# Altium project qfc_Alfa1.0.PrjPcb
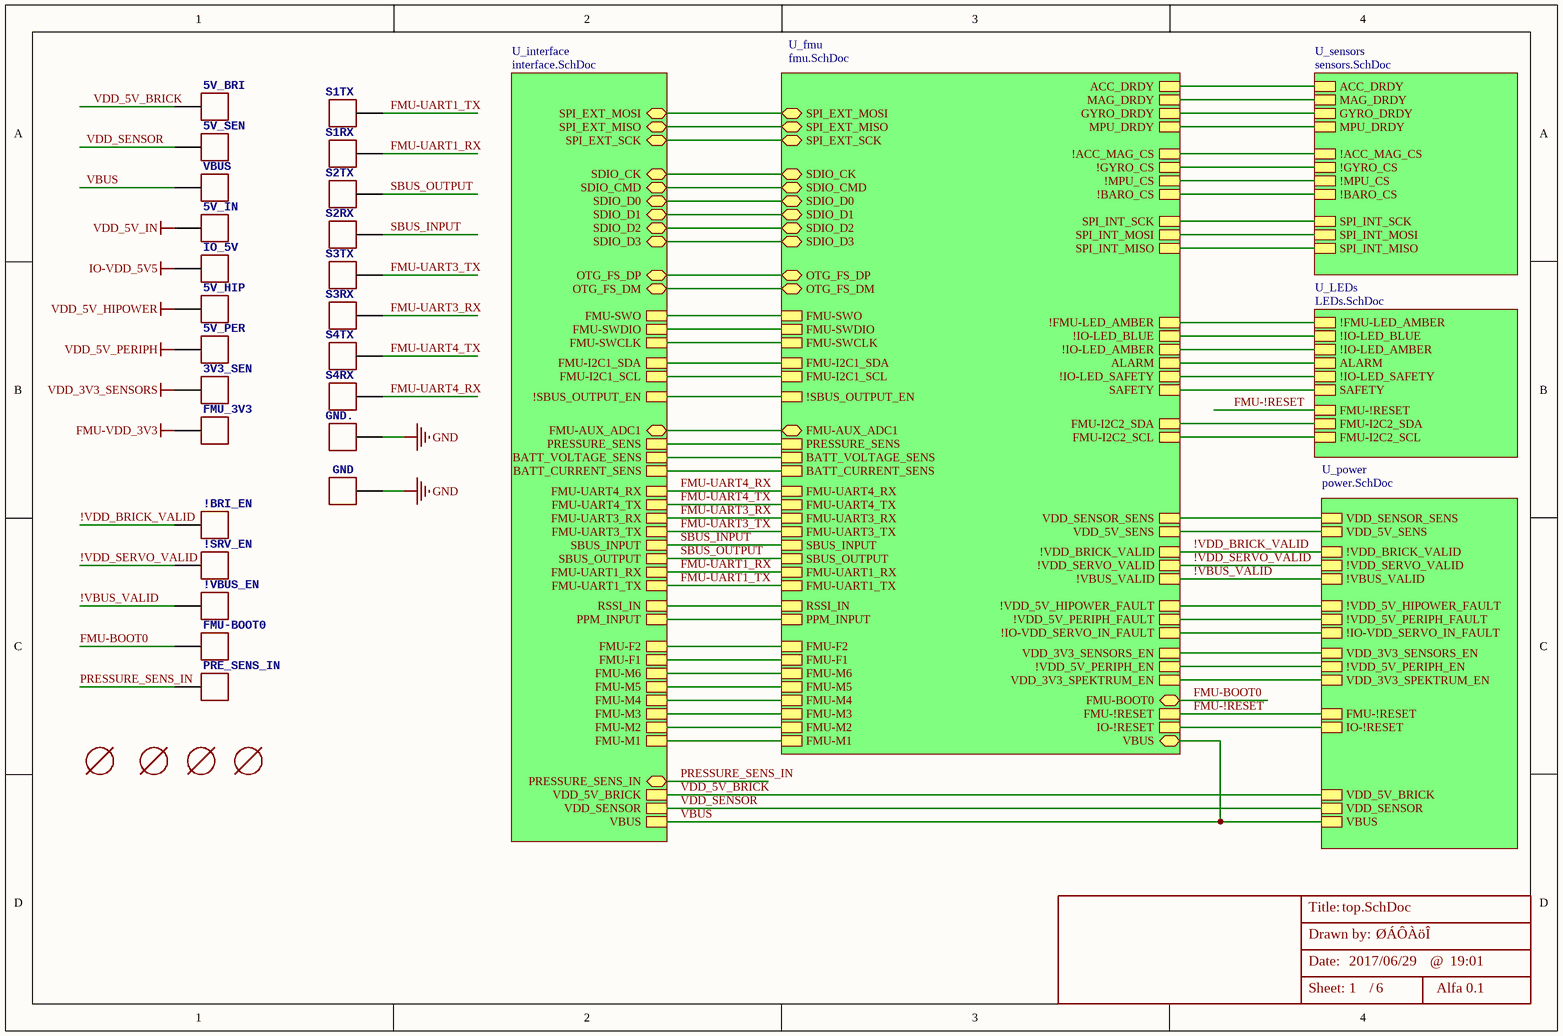
[diagram p0: top.SchDoc]
6 sheets, 217 parts. Net scope: hierarchical (ports join the sheet entries above them; power ports are global).
Board file: qfc.PcbDoc
Sheets:
  top.SchDoc
    U_interface = interface.SchDoc
    U_fmu = fmu.SchDoc
    U_LEDs = LEDs.SchDoc
    U_sensors = sensors.SchDoc
    U_power = power.SchDoc

## Sheet top.SchDoc: Your title
size A4; Date: 2017/06/29; DrawnBy: ØÁÔÀöÎ; Revision: Alfa 0.1; SheetNumber: 1; SheetTotal: 6; Time: 19:01

### Parts
3V3_SEN  PAD.04  [PAD.04X.04]  (value not drawn)
5V_BRI  PAD.04  [PAD.04X.04]  (value not drawn)
5V_HIP  PAD.04  [PAD.04X.04]  (value not drawn)
5V_IN  PAD.04  [PAD.04X.04]  (value not drawn)
5V_PER  PAD.04  [PAD.04X.04]  (value not drawn)
5V_SEN  PAD.04  [PAD.04X.04]  (value not drawn)
!BRI_EN  PAD.04  [PAD.04X.04]  (value not drawn)
!SRV_EN  PAD.04  [PAD.04X.04]  (value not drawn)
!VBUS_EN  PAD.04  [PAD.04X.04]  (value not drawn)
FMU-BOOT0  PAD.04  [PAD.04X.04]  (value not drawn)
FMU_3V3  PAD.04  [PAD.04X.04]  (value not drawn)
GND  PAD.04  [PAD.04X.04]  (value not drawn)
GND.  PAD.04  [PAD.04X.04]  (value not drawn)
IO_5V  PAD.04  [PAD.04X.04]  (value not drawn)
M100  MOUNT-HOLE1.8MM  [HOLE-3mm]  (value not drawn)
M101  MOUNT-HOLE1.8MM  [HOLE-3mm]  (value not drawn)
M102  MOUNT-HOLE1.8MM  [HOLE-3mm]  (value not drawn)
M103  MOUNT-HOLE1.8MM  [HOLE-3mm]  (value not drawn)
PRE_SENS_IN  PAD.04  [PAD.04X.04]  (value not drawn)
S1RX  PAD.04  [PAD.04X.04]  (value not drawn)
S1TX  PAD.04  [PAD.04X.04]  (value not drawn)
S2RX  PAD.04  [PAD.04X.04]  (value not drawn)
S2TX  PAD.04  [PAD.04X.04]  (value not drawn)
S3RX  PAD.04  [PAD.04X.04]  (value not drawn)
S3TX  PAD.04  [PAD.04X.04]  (value not drawn)
S4RX  PAD.04  [PAD.04X.04]  (value not drawn)
S4TX  PAD.04  [PAD.04X.04]  (value not drawn)
VBUS  PAD.04  [PAD.04X.04]  (value not drawn)

### Sub-sheets
U_fmu = fmu.SchDoc: FMU-M1, FMU-M2, FMU-M3, FMU-M4, FMU-M5, FMU-M6, FMU-F1, FMU-F2, PPM_INPUT, SBUS_INPUT, SBUS_OUTPUT, !SBUS_OUTPUT_EN, RSSI_IN, FMU-UART1_TX, FMU-UART1_RX, FMU-UART3_TX, FMU-UART3_RX, FMU-UART4_TX, FMU-UART4_RX, BATT_CURRENT_SENS, BATT_VOLTAGE_SENS, PRESSURE_SENS, FMU-I2C1_SCL, FMU-I2C1_SDA, FMU-SWCLK, FMU-SWDIO, FMU-SWO, !VDD_BRICK_VALID, !VDD_SERVO_VALID, !VBUS_VALID, VDD_SENSOR_SENS, VDD_3V3_SENSORS_EN, FMU-!RESET, !VDD_5V_HIPOWER_FAULT, !VDD_5V_PERIPH_FAULT, VDD_5V_SENS, !VDD_5V_PERIPH_EN, VDD_3V3_SPEKTRUM_EN, IO-!RESET, GYRO_DRDY, ACC_DRDY, MAG_DRDY, MPU_DRDY, !GYRO_CS, !ACC_MAG_CS, !MPU_CS, !BARO_CS, SPI_INT_SCK, SPI_INT_MOSI, SPI_INT_MISO, !FMU-LED_AMBER, !IO-LED_BLUE, !IO-LED_AMBER, FMU-I2C2_SDA, FMU-I2C2_SCL, !IO-LED_SAFETY, SAFETY, OTG_FS_DP, OTG_FS_DM, !IO-VDD_SERVO_IN_FAULT, FMU-AUX_ADC1, VBUS, ALARM, SDIO_CK, SDIO_CMD, SDIO_D0, SDIO_D1, SDIO_D2, SDIO_D3, SPI_EXT_MOSI, SPI_EXT_MISO, SPI_EXT_SCK, FMU-BOOT0
U_interface = interface.SchDoc: FMU-M1, FMU-M2, FMU-M3, FMU-M4, FMU-M5, FMU-M6, FMU-F1, FMU-F2, PPM_INPUT, SBUS_INPUT, SBUS_OUTPUT, !SBUS_OUTPUT_EN, RSSI_IN, FMU-UART1_TX, FMU-UART1_RX, FMU-UART3_TX, FMU-UART3_RX, FMU-UART4_TX, FMU-UART4_RX, VDD_SENSOR, VDD_5V_BRICK, BATT_CURRENT_SENS, BATT_VOLTAGE_SENS, PRESSURE_SENS, FMU-I2C1_SCL, FMU-I2C1_SDA, FMU-SWCLK, FMU-SWDIO, FMU-SWO, VBUS, OTG_FS_DP, OTG_FS_DM, SDIO_CK, SDIO_CMD, SDIO_D0, SDIO_D1, SDIO_D2, SDIO_D3, SPI_EXT_MOSI, SPI_EXT_MISO, SPI_EXT_SCK, FMU-AUX_ADC1, PRESSURE_SENS_IN
U_LEDs = LEDs.SchDoc: !FMU-LED_AMBER, !IO-LED_BLUE, !IO-LED_AMBER, ALARM, FMU-I2C2_SDA, FMU-I2C2_SCL, FMU-!RESET, !IO-LED_SAFETY, SAFETY
U_power = power.SchDoc: VBUS, VDD_5V_BRICK, VDD_SENSOR, !VDD_BRICK_VALID, !VDD_SERVO_VALID, !VBUS_VALID, VDD_SENSOR_SENS, VDD_3V3_SENSORS_EN, FMU-!RESET, !VDD_5V_HIPOWER_FAULT, !VDD_5V_PERIPH_FAULT, VDD_5V_SENS, !VDD_5V_PERIPH_EN, !IO-VDD_SERVO_IN_FAULT, VDD_3V3_SPEKTRUM_EN, IO-!RESET
U_sensors = sensors.SchDoc: GYRO_DRDY, ACC_DRDY, MAG_DRDY, MPU_DRDY, !GYRO_CS, !ACC_MAG_CS, !MPU_CS, !BARO_CS, SPI_INT_SCK, SPI_INT_MOSI, SPI_INT_MISO

### Nets
FMU-VDD_3V3: FMU_3V3.P$1
GND: GND.P$1 GND..P$1
IO-VDD_5V5: IO_5V.P$1
VDD_3V3_SENSORS: 3V3_SEN.P$1
VDD_5V_HIPOWER: 5V_HIP.P$1
VDD_5V_IN: 5V_IN.P$1
VDD_5V_PERIPH: 5V_PER.P$1
!VBUS_VALID: !VBUS_EN.P$1 ; sheet U_fmu/!VBUS_VALID, sheet U_power/!VBUS_VALID
!VDD_BRICK_VALID: !BRI_EN.P$1 ; sheet U_fmu/!VDD_BRICK_VALID, sheet U_power/!VDD_BRICK_VALID
!VDD_SERVO_VALID: !SRV_EN.P$1 ; sheet U_fmu/!VDD_SERVO_VALID, sheet U_power/!VDD_SERVO_VALID
FMU-!RESET: sheet U_fmu/FMU-!RESET, sheet U_LEDs/FMU-!RESET, sheet U_power/FMU-!RESET
FMU-BOOT0: FMU-BOOT0.P$1 ; sheet U_fmu/FMU-BOOT0
FMU-UART1_RX: S1RX.P$1 ; sheet U_interface/FMU-UART1_RX, sheet U_fmu/FMU-UART1_RX
FMU-UART1_TX: S1TX.P$1 ; sheet U_interface/FMU-UART1_TX, sheet U_fmu/FMU-UART1_TX
FMU-UART3_RX: S3RX.P$1 ; sheet U_interface/FMU-UART3_RX, sheet U_fmu/FMU-UART3_RX
FMU-UART3_TX: S3TX.P$1 ; sheet U_interface/FMU-UART3_TX, sheet U_fmu/FMU-UART3_TX
FMU-UART4_RX: S4RX.P$1 ; sheet U_interface/FMU-UART4_RX, sheet U_fmu/FMU-UART4_RX
FMU-UART4_TX: S4TX.P$1 ; sheet U_interface/FMU-UART4_TX, sheet U_fmu/FMU-UART4_TX
PRESSURE_SENS_IN: PRE_SENS_IN.P$1 ; sheet U_interface/PRESSURE_SENS_IN
SBUS_INPUT: S2RX.P$1 ; sheet U_interface/SBUS_INPUT, sheet U_fmu/SBUS_INPUT
SBUS_OUTPUT: S2TX.P$1 ; sheet U_interface/SBUS_OUTPUT, sheet U_fmu/SBUS_OUTPUT
SPI_INT_MISO: sheet U_fmu/SPI_INT_MISO, sheet U_sensors/SPI_INT_MISO
SPI_INT_MOSI: sheet U_fmu/SPI_INT_MOSI, sheet U_sensors/SPI_INT_MOSI
SPI_INT_SCK: sheet U_fmu/SPI_INT_SCK, sheet U_sensors/SPI_INT_SCK
VBUS: VBUS.P$1 ; sheet U_interface/VBUS, sheet U_fmu/VBUS, sheet U_power/VBUS
VDD_5V_BRICK: 5V_BRI.P$1 ; sheet U_interface/VDD_5V_BRICK, sheet U_power/VDD_5V_BRICK
VDD_SENSOR: 5V_SEN.P$1 ; sheet U_interface/VDD_SENSOR, sheet U_power/VDD_SENSOR
NetC502_P$2: sheet U_interface/PRESSURE_SENS, sheet U_fmu/PRESSURE_SENS
NetD501_C: sheet U_interface/PPM_INPUT, sheet U_fmu/PPM_INPUT
NetJ400_GND: sheet U_fmu/SAFETY, sheet U_LEDs/SAFETY
NetJ507_2: sheet U_interface/SPI_EXT_SCK, sheet U_fmu/SPI_EXT_SCK
NetJ507_3: sheet U_interface/SPI_EXT_MOSI, sheet U_fmu/SPI_EXT_MOSI
NetJ507_4: sheet U_interface/SPI_EXT_MISO, sheet U_fmu/SPI_EXT_MISO
NetJ508_2: sheet U_interface/FMU-SWCLK, sheet U_fmu/FMU-SWCLK
NetJ508_3: sheet U_interface/FMU-SWDIO, sheet U_fmu/FMU-SWDIO
NetJ508_4: sheet U_interface/FMU-SWO, sheet U_fmu/FMU-SWO
NetR200_1: sheet U_fmu/VDD_3V3_SENSORS_EN, sheet U_power/VDD_3V3_SENSORS_EN
NetR214_1: sheet U_fmu/VDD_5V_SENS, sheet U_power/VDD_5V_SENS
NetR219_2: sheet U_fmu/!VDD_5V_PERIPH_EN, sheet U_power/!VDD_5V_PERIPH_EN
NetR225_1: sheet U_fmu/VDD_SENSOR_SENS, sheet U_power/VDD_SENSOR_SENS
NetR227_2: sheet U_fmu/VDD_3V3_SPEKTRUM_EN, sheet U_power/VDD_3V3_SPEKTRUM_EN
NetR403_1: sheet U_fmu/!IO-LED_BLUE, sheet U_LEDs/!IO-LED_BLUE
NetR405_1: sheet U_fmu/!FMU-LED_AMBER, sheet U_LEDs/!FMU-LED_AMBER
NetR406_1: sheet U_fmu/!IO-LED_AMBER, sheet U_LEDs/!IO-LED_AMBER
NetR410_1: sheet U_fmu/!IO-LED_SAFETY, sheet U_LEDs/!IO-LED_SAFETY
NetR411_1: sheet U_fmu/ALARM, sheet U_LEDs/ALARM
NetR500_2: sheet U_interface/BATT_CURRENT_SENS, sheet U_fmu/BATT_CURRENT_SENS
NetR503_2: sheet U_interface/BATT_VOLTAGE_SENS, sheet U_fmu/BATT_VOLTAGE_SENS
NetR516_1: sheet U_interface/FMU-AUX_ADC1, sheet U_fmu/FMU-AUX_ADC1
NetR521_2: sheet U_interface/FMU-I2C1_SCL, sheet U_fmu/FMU-I2C1_SCL
NetR522_2: sheet U_interface/FMU-I2C1_SDA, sheet U_fmu/FMU-I2C1_SDA
NetR527_1: sheet U_interface/RSSI_IN, sheet U_fmu/RSSI_IN
NetR528_1: sheet U_interface/SDIO_D2, sheet U_fmu/SDIO_D2
NetR529_1: sheet U_interface/SDIO_D3, sheet U_fmu/SDIO_D3
NetR530_1: sheet U_interface/SDIO_CMD, sheet U_fmu/SDIO_CMD
NetR531_1: sheet U_interface/SDIO_D0, sheet U_fmu/SDIO_D0
NetR532_1: sheet U_interface/SDIO_D1, sheet U_fmu/SDIO_D1
NetU204_4: sheet U_fmu/!VDD_5V_HIPOWER_FAULT, sheet U_power/!VDD_5V_HIPOWER_FAULT
NetU205_4: sheet U_fmu/!VDD_5V_PERIPH_FAULT, sheet U_power/!VDD_5V_PERIPH_FAULT
NetU207_4: sheet U_fmu/!IO-VDD_SERVO_IN_FAULT, sheet U_power/!IO-VDD_SERVO_IN_FAULT
NetU208_3: sheet U_fmu/IO-!RESET, sheet U_power/IO-!RESET
NetU300_5: sheet U_fmu/!BARO_CS, sheet U_sensors/!BARO_CS
NetU301_5: sheet U_fmu/!GYRO_CS, sheet U_sensors/!GYRO_CS
NetU301_6: sheet U_fmu/GYRO_DRDY, sheet U_sensors/GYRO_DRDY
NetU302_8: sheet U_fmu/!MPU_CS, sheet U_sensors/!MPU_CS
NetU302_12: sheet U_fmu/MPU_DRDY, sheet U_sensors/MPU_DRDY
NetU303_8: sheet U_fmu/!ACC_MAG_CS, sheet U_sensors/!ACC_MAG_CS
NetU303_9: sheet U_fmu/MAG_DRDY, sheet U_sensors/MAG_DRDY
NetU303_11: sheet U_fmu/ACC_DRDY, sheet U_sensors/ACC_DRDY
NetU401_2: sheet U_fmu/FMU-I2C2_SDA, sheet U_LEDs/FMU-I2C2_SDA
NetU401_3: sheet U_fmu/FMU-I2C2_SCL, sheet U_LEDs/FMU-I2C2_SCL
NetU500_1: sheet U_interface/FMU-M1, sheet U_fmu/FMU-M1
NetU500_3: sheet U_interface/FMU-M2, sheet U_fmu/FMU-M2
NetU500_4: sheet U_interface/FMU-M3, sheet U_fmu/FMU-M3
NetU500_5: sheet U_interface/FMU-M4, sheet U_fmu/FMU-M4
NetU500_6: sheet U_interface/FMU-M5, sheet U_fmu/FMU-M5
NetU500_7: sheet U_interface/FMU-M6, sheet U_fmu/FMU-M6
NetU500_8: sheet U_interface/FMU-F1, sheet U_fmu/FMU-F1
NetU500_9: sheet U_interface/FMU-F2, sheet U_fmu/FMU-F2
NetU502_7: sheet U_interface/!SBUS_OUTPUT_EN, sheet U_fmu/!SBUS_OUTPUT_EN
NetU503_4: sheet U_interface/OTG_FS_DP, sheet U_fmu/OTG_FS_DP
NetU503_6: sheet U_interface/OTG_FS_DM, sheet U_fmu/OTG_FS_DM
NetU504_5: sheet U_interface/SDIO_CK, sheet U_fmu/SDIO_CK

### Notes on the sheet
- Title:
- Date:
- Drawn by:
- @
- Sheet:       /

### Library data of the parts
3V3_SEN = PAD.04: VDD_3V3_SENSORS; BOM: EXCLUDE; PARTNO: *
5V_BRI = PAD.04: VDD_5V_BRICK; BOM: EXCLUDE; PARTNO: *
5V_HIP = PAD.04: VDD_5V_HIPOWER; BOM: EXCLUDE; PARTNO: *
5V_IN = PAD.04: VDD_5V_IN; BOM: EXCLUDE; PARTNO: *
5V_PER = PAD.04: VDD_5V_PERIPH; BOM: EXCLUDE; PARTNO: *
5V_SEN = PAD.04: VDD_SENSOR; BOM: EXCLUDE; PARTNO: *
!BRI_EN = PAD.04: !VDD_BRICK_VALID; BOM: EXCLUDE; PARTNO: *
!SRV_EN = PAD.04: !VDD_SERVO_VALID; BOM: EXCLUDE; PARTNO: *
!VBUS_EN = PAD.04: !VBUS_VALID; BOM: EXCLUDE; PARTNO: *
FMU-BOOT0 GND GND. S1RX S1TX S2RX S2TX S3RX S3TX S4RX S4TX VBUS = PAD.04: BOM: EXCLUDE; PARTNO: *
FMU_3V3 = PAD.04: FMU-VDD_3V3; BOM: EXCLUDE; PARTNO: *
IO_5V = PAD.04: IO-VDD_5V5; BOM: EXCLUDE; PARTNO: *
M100-M103 = MOUNT-HOLE1.8MM: BOM: EXCLUDE; PARTNO: *
PRE_SENS_IN = PAD.04: PRESSURE_SENS_IN; BOM: EXCLUDE; PARTNO: *

## Sheet interface.SchDoc: Your title
size A4; Date: 2017/06/29; DrawnBy: 亓岳鑫; Revision: Alfa 0.1; SheetNumber: 5; SheetTotal: 6; Time: 19:01
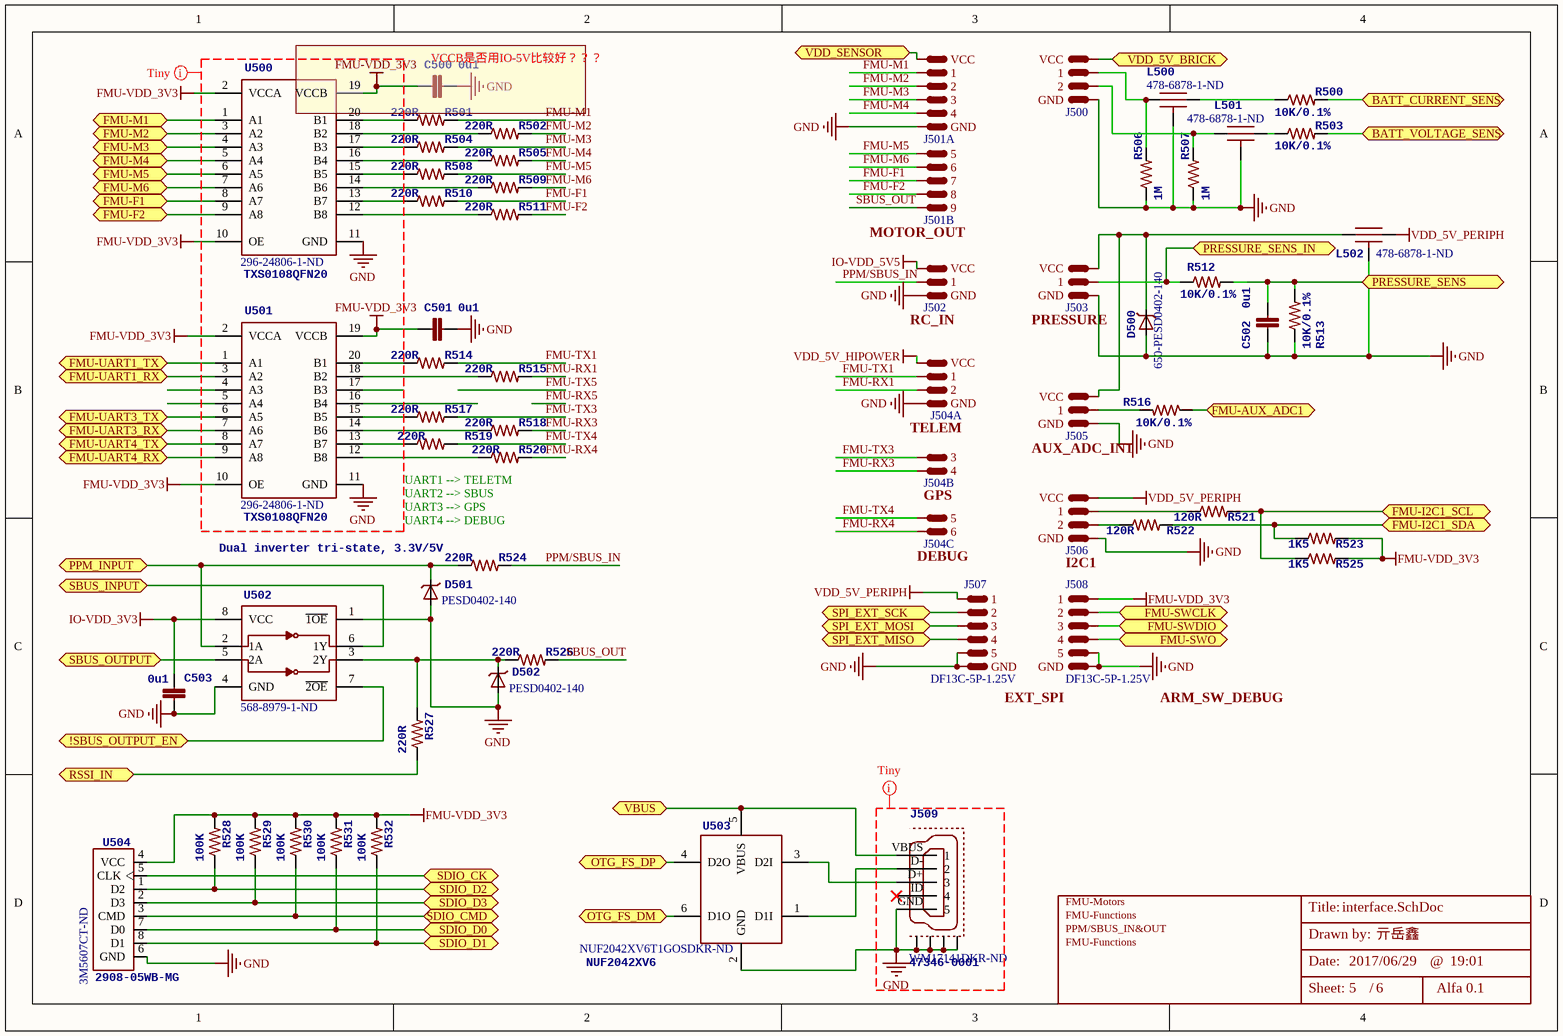
[diagram p1: interface.SchDoc]

### Parts
C500  0u1  [0603-CAP]
C501  0u1  [0603-CAP]
C502  0u1  [0603-CAP]
C503  0u1  [0603-CAP]
D500  Supplier Part Number 1: 650-PESD0402-140  [0402-TVS]  (hidden comment: DIODE-TVS)
D501  PARTNO: PESD0402-140  [0402-TVS]  (hidden comment: DIODE-TVS)
D502  PARTNO: PESD0402-140  [0402-TVS]  (hidden comment: DIODE-TVS)
J500  HDR 3X2  [HDR3X2H]  (value not drawn)
J501  HDR 3X9  [HDR3X9H]  (value not drawn)  (parts A,B of 2)
J502  HDR 3X1  [HDR3X1H]  (value not drawn)
J503  HDR 3X1  [HDR3X1H]  (value not drawn)
J504  HDR 4X3  [HDR4X3]  (value not drawn)  (parts A,B,C of 3)
J505  HDR 3X1  [HDR3X1H]  (value not drawn)
J506  HDR 4X1  [HDR4X1]  (value not drawn)
J507  DF13C-5P-1.25V  [1.25-5P]
J508  DF13C-5P-1.25V  [1.25-5P]
J509  47346-0001  Supplier Part Number 1: WM17141DKR-ND  [MOLEX-47346-0001]
L500  Supplier Part Number 1: 478-6878-1-ND  [KYOCERA-KNH16-DA]  (hidden comment: Kyocera KNH16C104DA5TS EMI filter)
L501  Supplier Part Number 1: 478-6878-1-ND  [KYOCERA-KNH16-DA]  (hidden comment: Kyocera KNH16C104DA5TS EMI filter)
L502  Supplier Part Number 1: 478-6878-1-ND  [KYOCERA-KNH16-DA]  (hidden comment: Kyocera KNH16C104DA5TS EMI filter)
R500  10K/0.1%  [0603-RES]
R501  220R  [0603-RES]
R502  220R  [0603-RES]
R503  10K/0.1%  [0603-RES]
R504  220R  [0603-RES]
R505  220R  [0603-RES]
R506  1M  [0603-RES]
R507  1M  [0603-RES]
R508  220R  [0603-RES]
R509  220R  [0603-RES]
R510  220R  [0603-RES]
R511  220R  [0603-RES]
R512  10K/0.1%  [0603-RES]
R513  10K/0.1%  [0603-RES]
R514  220R  [0603-RES]
R515  220R  [0603-RES]
R516  10K/0.1%  [0603-RES]
R517  220R  [0603-RES]
R518  220R  [0603-RES]
R519  220R  [0603-RES]
R520  220R  [0603-RES]
R521  120R  [0603-RES]
R522  120R  [0603-RES]
R523  1K5  [0603-RES]
R524  220R  [0603-RES]
R525  1K5  [0603-RES]
R526  220R  [0603-RES]
R527  220R  [0603-RES]
R528  100K  [0603-RES]
R529  100K  [0603-RES]
R530  100K  [0603-RES]
R531  100K  [0603-RES]
R532  100K  [0603-RES]
U500  TXS0108QFN20  Supplier Part Number 1: 296-24806-1-ND  [QFN20-RGY]
U501  TXS0108QFN20  Supplier Part Number 1: 296-24806-1-ND  [QFN20-RGY]
U502  Dual inverter tri-state, 3.3V/5V  Supplier Part Number 1: 568-8979-1-ND  [TSSOP8_SOT505-2]
U503  NUF2042XV6  Supplier Part Number 1: NUF2042XV6T1GOSDKR-ND  [SOT563-6]
U504  2908-05WB-MG  Supplier Part Number 1: 3M5607CT-ND  [MICROSD]

### Blocks framed on the sheet
VCCB是否用IO-5V比较好？？？: C500

### Ports
!SBUS_OUTPUT_EN, BATT_CURRENT_SENS, BATT_VOLTAGE_SENS, FMU-AUX_ADC1, FMU-F1, FMU-F2, FMU-I2C1_SCL, FMU-I2C1_SDA, FMU-M1, FMU-M2, FMU-M3, FMU-M4, FMU-M5, FMU-M6, FMU-SWCLK, FMU-SWDIO, FMU-SWO, FMU-UART1_RX, FMU-UART1_TX, FMU-UART3_RX, FMU-UART3_TX, FMU-UART4_RX, FMU-UART4_TX, OTG_FS_DM, OTG_FS_DP, PPM_INPUT, PRESSURE_SENS, PRESSURE_SENS_IN, RSSI_IN, SBUS_INPUT, SBUS_OUTPUT, SDIO_CK, SDIO_CMD, SDIO_D0, SDIO_D1, SDIO_D2, SDIO_D3, SPI_EXT_MISO, SPI_EXT_MOSI, SPI_EXT_SCK, VBUS, VDD_5V_BRICK, VDD_SENSOR

### Nets
FMU-VDD_3V3: C500.P$1 C501.P$1 C503.P$1 J508.1 R523.2 R525.2 R528.2 R529.2 R530.2 R531.2 R532.2 U500.2(VCCA) U500.10(OE) U500.19(VCCB) U501.2(VCCA) U501.10(OE) U501.19(VCCB) U502.8(VCC) U504.4(VCC)  [also labelled IO-VDD_3V3]
GND: C500.P$2 C501.P$2 C502.P$1 C503.P$2 D500.A D501.A D502.A J500.GND J501.GND J502.GND J503.GND J504.GND J505.GND J506.GND J507.5 J507.GND J508.5 J508.GND J509.GND(5) J509.GND1 J509.GND2 J509.GND3 J509.GND4 L500.GND L501.GND L502.GND R506.1 R507.1 R513.1 U500.11(GND) U501.11(GND) U502.1(~{1OE}) U502.4(GND) U503.2(GND) U504.6(GND)
IO-VDD_5V5: J502.VCC
VDD_5V_HIPOWER: J504.VCC
VDD_5V_PERIPH: J506.VCC J507.1 L502.P$2
FMU-F1: J501.7 R510.2
FMU-F2: J501.8 R511.2
FMU-M1: J501.1 R501.2
FMU-M2: J501.2 R502.2
FMU-M3: J501.3 R504.2
FMU-M4: J501.4 R505.2
FMU-M5: J501.5 R508.2
FMU-M6: J501.6 R509.2
FMU-RX1: J504.2 R515.2
FMU-RX3: J504.4 R518.2
FMU-RX4: J504.6 R520.2
FMU-TX1: J504.1 R514.2
FMU-TX3: J504.3 R517.2
FMU-TX4: J504.5 R519.2
FMU-UART1_RX: U501.3(A2) ; port FMU-UART1_RX
FMU-UART1_TX: U501.1(A1) ; port FMU-UART1_TX
FMU-UART3_RX: U501.7(A6) ; port FMU-UART3_RX
FMU-UART3_TX: U501.6(A5) ; port FMU-UART3_TX
FMU-UART4_RX: U501.9(A8) ; port FMU-UART4_RX
FMU-UART4_TX: U501.8(A7) ; port FMU-UART4_TX
PPM/SBUS_IN: J502.1 R524.2
PRESSURE_SENS_IN: J503.1 R512.1 ; port PRESSURE_SENS_IN
SBUS_INPUT: U502.6(1Y) ; port SBUS_INPUT
SBUS_OUT: J501.9 R526.2
SBUS_OUTPUT: U502.5(2A) ; port SBUS_OUTPUT
VBUS: J509.VBUS(1) U503.5(VBUS) ; port VBUS
VDD_5V_BRICK: J500.VCC ; port VDD_5V_BRICK
VDD_SENSOR: J501.VCC ; port VDD_SENSOR
NetC502_P$2: C502.P$2 R512.2 R513.2 ; port PRESSURE_SENS
NetD500_C: D500.C J503.VCC J505.VCC L502.P$1
NetD501_C: D501.C R524.1 U502.2(1A) ; port PPM_INPUT
NetD502_C: D502.C R526.1 R527.2 U502.3(2Y)
NetJ500_1: J500.1 L500.P$1 R506.2
NetJ500_2: J500.2 L501.P$1 R507.2
NetJ505_1: J505.1 R516.2
NetJ506_1: J506.1 R521.1
NetJ506_2: J506.2 R522.1
NetJ507_2: J507.2 ; port SPI_EXT_SCK
NetJ507_3: J507.3 ; port SPI_EXT_MOSI
NetJ507_4: J507.4 ; port SPI_EXT_MISO
NetJ508_2: J508.2 ; port FMU-SWCLK
NetJ508_3: J508.3 ; port FMU-SWDIO
NetJ508_4: J508.4 ; port FMU-SWO
NetJ509_D+: J509.D+(3) U503.3(D2I)
NetJ509_D-: J509.D-(2) U503.1(D1I)
NetL500_P$2: L500.P$2 R500.1
NetL501_P$2: L501.P$2 R503.1
NetR500_2: R500.2 ; port BATT_CURRENT_SENS
NetR501_1: R501.1 U500.20(B1)
NetR502_1: R502.1 U500.18(B2)
NetR503_2: R503.2 ; port BATT_VOLTAGE_SENS
NetR504_1: R504.1 U500.17(B3)
NetR505_1: R505.1 U500.16(B4)
NetR508_1: R508.1 U500.15(B5)
NetR509_1: R509.1 U500.14(B6)
NetR510_1: R510.1 U500.13(B7)
NetR511_1: R511.1 U500.12(B8)
NetR514_1: R514.1 U501.20(B1)
NetR515_1: R515.1 U501.18(B2)
NetR516_1: R516.1 ; port FMU-AUX_ADC1
NetR517_1: R517.1 U501.15(B5)
NetR518_1: R518.1 U501.14(B6)
NetR519_1: R519.1 U501.13(B7)
NetR520_1: R520.1 U501.12(B8)
NetR521_2: R521.2 R525.1 ; port FMU-I2C1_SCL
NetR522_2: R522.2 R523.1 ; port FMU-I2C1_SDA
NetR527_1: R527.1 ; port RSSI_IN
NetR528_1: R528.1 U504.1(D2) ; port SDIO_D2
NetR529_1: R529.1 U504.2(D3) ; port SDIO_D3
NetR530_1: R530.1 U504.3(CMD) ; port SDIO_CMD
NetR531_1: R531.1 U504.7(D0) ; port SDIO_D0
NetR532_1: R532.1 U504.8(D1) ; port SDIO_D1
NetU500_1: U500.1(A1) ; port FMU-M1
NetU500_3: U500.3(A2) ; port FMU-M2
NetU500_4: U500.4(A3) ; port FMU-M3
NetU500_5: U500.5(A4) ; port FMU-M4
NetU500_6: U500.6(A5) ; port FMU-M5
NetU500_7: U500.7(A6) ; port FMU-M6
NetU500_8: U500.8(A7) ; port FMU-F1
NetU500_9: U500.9(A8) ; port FMU-F2
NetU502_7: U502.7(~{2OE}) ; port !SBUS_OUTPUT_EN
NetU503_4: U503.4(D2O) ; port OTG_FS_DP
NetU503_6: U503.6(D1O) ; port OTG_FS_DM
NetU504_5: U504.5(CLK) ; port SDIO_CK

Not connected (* = marked no-connect by the designer): J509 ID(4)*; U501 4(A3) 5(A4) 16(B4) 17(B3)

### Layout directives
net class Tiny_componet: FMU-VDD_3V3, GND

### Notes on the sheet
- MOTOR_OUT
- (near J502) RC_IN
- (near J503) PRESSURE
- (near J504) TELEM
- (near J504) GPS
- (near J505) AUX_ADC_IN1
- (near R520) UART1 --> TELETM
  UART2 --> SBUS
  UART3 --> GPS
  UART4 --> DEBUG
- (near J504) DEBUG
- I2C1
- (near J507) EXT_SPI
- (near J508) ARM_SW_DEBUG
- FMU-Motors
- FMU-Functions
- PPM/SBUS_IN&OUT
- Title:
- Date:
- Drawn by:
- @
- Sheet:       /

### Library data of the parts
C500-C503 = CAP0603: CAP CER 2.2UF 16V 10% X6S 0603; PARTNO: C1608X6S1C225K080AC; 3DR_PARTNO: ECM0619; Supplier 1: Digi-Key; Value: 0u1; Supplier Part Number 1: 445-7438-1-ND
D500 = DIODE-TVS: TVS DIODE 14VWM 40VC 0402; 3DR_PARTNO: ECM0837; PARTNO: PESD0402-140; Value: 40v; Supplier 1: Mouser
D501 D502 = DIODE-TVS: TVS DIODE 14VWM 40VC 0402; 3DR_PARTNO: ECM0837; Value: 40v; Supplier 1: Mouser; Supplier Part Number 1: 650-PESD0402-140
J500 = HDR 3X2: Header 3X2 pins
J501 = HDR 3X9: Header 3X9 pins
J502 J503 J505 = HDR 3X1: Header 3X1 pins
J504 = HDR 4X3: Header 4X3
J506 = HDR 4X1: Header 4X1
J507 J508 = DF13C-5P-1.25V: DF13C-5P-1.25V, 1.25mm
J509 = MOLEX-47346-0001: MICRO USB B, BOTTOM MOUNT; 3DR_PARTNO: ECM0486; PARTNO: 0473460001; Supplier 1: Digi-Key
L500-L502 = KNH16C104DA5TS: FILTER CAP 0.1UF 2A 25V 0603; 3DR_PARTNO: ECM0719; Value: 0u1; Supplier 1: Digi-Key; PARTNO: KNH16C104DA5TS
R500-R532 = RESISTOR0603-RES: RES 10 OHM 1/10W 5% 0603; PARTNO: RC1608J100CS; 3DR_PARTNO: ECM0811; Supplier 1: Digi-Key; Supplier Part Number 1: 1276-5014-1-ND
  R500 R503 R512 R513 R516: Value: 10K/0.1%
  R501 R502 R504 R505 R508-R511 R514 R515 R517-R520 R524 R526 R527: Value: 220R
  R506 R507: Value: 1M
  R521 R522: Value: 120R
  R523 R525: Value: 1K5
  R528-R532: Value: 100K
U500 U501 = TXS0108QFN20: IC XLATR VOLT-LVL 8B BDIR 20QFN; 3DR_PARTNO: ECM0845; PARTNO: TXS0108ERGYR; Supplier 1: Digi-Key
U502 = 74LVC2G240-TSSOP-8: IC INVERTER DUAL 4-INPUT 8TSSOP; 3DR_PARTNO: ECM0817; PARTNO: 74LVC2G240DP,125; Value: INV; Supplier 1: Digi-Key
U503 = NUF2042XV6: IC FILTER USB ESD PROTECT SOT363; PARTNO: NUF2042XV6T1G; 3DR_PARTNO: ECM0836; Supplier 1: Digi-Key
U504 = MICROSDSDI: CONN MICRO SD CARD PUSH-PUSH R/A; 3DR_PARTNO: ECM0485; PARTNO: 2908-05WB-MG; Supplier 1: Digi-Key

## Sheet fmu.SchDoc: Your title
size A4; Date: 2017/06/29; DrawnBy: ØÁÔÀöÎ; Revision: Alfa 0.1; SheetNumber: 6; SheetTotal: 6; Time: 19:01
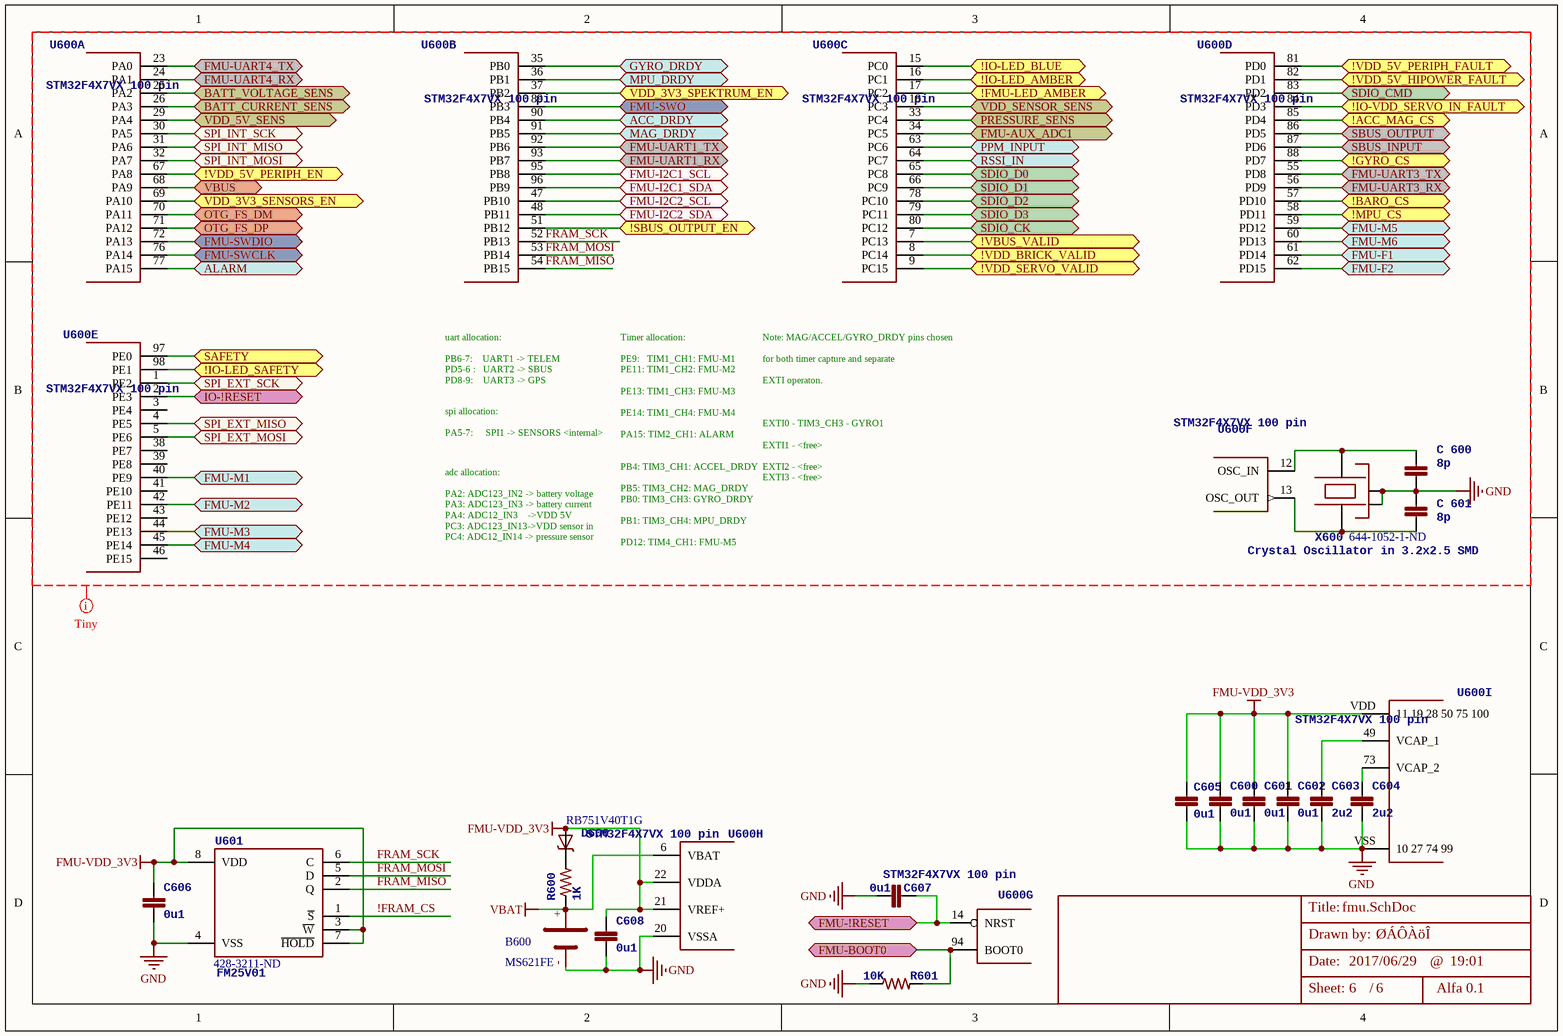
[diagram p2: fmu.SchDoc]

### Parts
B600  MS621FE  [MS621FE]
C600  0u1  [0603-CAP]
C601  0u1  [0603-CAP]
C602  0u1  [0603-CAP]
C603  2u2  [0603-CAP]
C604  2u2  [0603-CAP]
C605  0u1  [0603-CAP]
C606  0u1  [0603-CAP]
C607  0u1  [0603-CAP]
C608  0u1  [0603-CAP]
C_600  8p  [0603-CAP]
C_601  8p  [0603-CAP]
D600  PARTNO: RB751V40T1G  [SOD323]  (hidden comment: Schottky barrier diode)
R600  1K  [0603-RES]
R601  10K  [0603-RES]
U600  STM32F4X7VX 100 pin  [TQFP100]  (parts A,B,C,D,E,F,G,H,I of 9)
U601  FM25V01  Supplier Part Number 1: 428-3211-ND  [SO08]
X600  Crystal Oscillator in 3.2x2.5 SMD  Supplier Part Number 1: 644-1052-1-ND  [OSCILLATOR-3.2X2.5]

### Ports
!ACC_MAG_CS, !BARO_CS, !FMU-LED_AMBER, !GYRO_CS, !IO-LED_AMBER, !IO-LED_BLUE, !IO-LED_SAFETY, !IO-VDD_SERVO_IN_FAULT, !MPU_CS, !SBUS_OUTPUT_EN, !VBUS_VALID, !VDD_5V_HIPOWER_FAULT, !VDD_5V_PERIPH_EN, !VDD_5V_PERIPH_FAULT, !VDD_BRICK_VALID, !VDD_SERVO_VALID, ACC_DRDY, ALARM, BATT_CURRENT_SENS, BATT_VOLTAGE_SENS, FMU-!RESET, FMU-AUX_ADC1, FMU-BOOT0, FMU-F1, FMU-F2, FMU-I2C1_SCL, FMU-I2C1_SDA, FMU-I2C2_SCL, FMU-I2C2_SDA, FMU-M1, FMU-M2, FMU-M3, FMU-M4, FMU-M5, FMU-M6, FMU-SWCLK, FMU-SWDIO, FMU-SWO, FMU-UART1_RX, FMU-UART1_TX, FMU-UART3_RX, FMU-UART3_TX, FMU-UART4_RX, FMU-UART4_TX, GYRO_DRDY, IO-!RESET, MAG_DRDY, MPU_DRDY, OTG_FS_DM, OTG_FS_DP, PPM_INPUT, PRESSURE_SENS, RSSI_IN, SAFETY, SBUS_INPUT, SBUS_OUTPUT, SDIO_CK, SDIO_CMD, SDIO_D0, SDIO_D1, SDIO_D2, SDIO_D3, SPI_EXT_MISO, SPI_EXT_MOSI, SPI_EXT_SCK, SPI_INT_MISO, SPI_INT_MOSI, SPI_INT_SCK, VBUS, VDD_3V3_SENSORS_EN, VDD_3V3_SPEKTRUM_EN, VDD_5V_SENS, VDD_SENSOR_SENS

### Nets
FMU-VDD_3V3: C600.P$1 C601.P$1 C602.P$1 C605.P$1 C606.P$1 C608.P$1 D600.A U600.21(VREF+) U600.22(VDDA) U600.VDD(11_19_28_50_75_100) U601.3(~{W}) U601.7(~{HOLD}) U601.8(VDD)
GND: B600.- C600.P$2 C601.P$2 C602.P$2 C603.P$2 C604.P$2 C605.P$2 C606.P$2 C607.P$1 C608.P$2 C_600.P$2 C_601.P$1 R601.1 U600.20(VSSA) U600.VSS(10_27_74_99) U601.4(VSS) X600.2(NC_2) X600.4(NC_4)
VBAT: B600.+ R600.1 U600.6(VBAT)
!FRAM_CS: U601.1(~{S})
!VBUS_VALID: U600.7(PC13) ; port !VBUS_VALID
!VDD_BRICK_VALID: U600.8(PC14) ; port !VDD_BRICK_VALID
!VDD_SERVO_VALID: U600.9(PC15) ; port !VDD_SERVO_VALID
FMU-!RESET: C607.P$2 U600.14(NRST) ; port FMU-!RESET
FMU-BOOT0: R601.2 U600.94(BOOT0) ; port FMU-BOOT0
FMU-UART1_RX: U600.93(PB7) ; port FMU-UART1_RX
FMU-UART1_TX: U600.92(PB6) ; port FMU-UART1_TX
FMU-UART3_RX: U600.56(PD9) ; port FMU-UART3_RX
FMU-UART3_TX: U600.55(PD8) ; port FMU-UART3_TX
FMU-UART4_RX: U600.24(PA1) ; port FMU-UART4_RX
FMU-UART4_TX: U600.23(PA0) ; port FMU-UART4_TX
FRAM_MISO: U600.54(PB15) U601.2(Q)
FRAM_MOSI: U600.53(PB14) U601.5(D)
FRAM_SCK: U600.52(PB13) U601.6(C)
SBUS_INPUT: U600.87(PD6) ; port SBUS_INPUT
SBUS_OUTPUT: U600.86(PD5) ; port SBUS_OUTPUT
SPI_INT_MISO: U600.31(PA6) ; port SPI_INT_MISO
SPI_INT_MOSI: U600.32(PA7) ; port SPI_INT_MOSI
SPI_INT_SCK: U600.30(PA5) ; port SPI_INT_SCK
VBUS: U600.68(PA9) ; port VBUS
NetC502_P$2: U600.33(PC4) ; port PRESSURE_SENS
NetC603_P$1: C603.P$1 U600.49(VCAP_1)
NetC604_P$1: C604.P$1 U600.73(VCAP_2)
NetC_600_P$1: C_600.P$1 U600.12(OSC_IN) X600.3
NetC_601_P$2: C_601.P$2 U600.13(OSC_OUT) X600.1
NetD501_C: U600.63(PC6) ; port PPM_INPUT
NetD600_C: D600.C R600.2
NetJ400_GND: U600.97(PE0) ; port SAFETY
NetJ507_2: U600.1(PE2) ; port SPI_EXT_SCK
NetJ507_3: U600.5(PE6) ; port SPI_EXT_MOSI
NetJ507_4: U600.4(PE5) ; port SPI_EXT_MISO
NetJ508_2: U600.76(PA14) ; port FMU-SWCLK
NetJ508_3: U600.72(PA13) ; port FMU-SWDIO
NetJ508_4: U600.89(PB3) ; port FMU-SWO
NetR200_1: U600.69(PA10) ; port VDD_3V3_SENSORS_EN
NetR214_1: U600.29(PA4) ; port VDD_5V_SENS
NetR219_2: U600.67(PA8) ; port !VDD_5V_PERIPH_EN
NetR225_1: U600.18(PC3) ; port VDD_SENSOR_SENS
NetR227_2: U600.37(PB2) ; port VDD_3V3_SPEKTRUM_EN
NetR403_1: U600.15(PC0) ; port !IO-LED_BLUE
NetR405_1: U600.17(PC2) ; port !FMU-LED_AMBER
NetR406_1: U600.16(PC1) ; port !IO-LED_AMBER
NetR410_1: U600.98(PE1) ; port !IO-LED_SAFETY
NetR411_1: U600.77(PA15) ; port ALARM
NetR500_2: U600.26(PA3) ; port BATT_CURRENT_SENS
NetR503_2: U600.25(PA2) ; port BATT_VOLTAGE_SENS
NetR516_1: U600.34(PC5) ; port FMU-AUX_ADC1
NetR521_2: U600.95(PB8) ; port FMU-I2C1_SCL
NetR522_2: U600.96(PB9) ; port FMU-I2C1_SDA
NetR527_1: U600.64(PC7) ; port RSSI_IN
NetR528_1: U600.78(PC10) ; port SDIO_D2
NetR529_1: U600.79(PC11) ; port SDIO_D3
NetR530_1: U600.83(PD2) ; port SDIO_CMD
NetR531_1: U600.65(PC8) ; port SDIO_D0
NetR532_1: U600.66(PC9) ; port SDIO_D1
NetU204_4: U600.82(PD1) ; port !VDD_5V_HIPOWER_FAULT
NetU205_4: U600.81(PD0) ; port !VDD_5V_PERIPH_FAULT
NetU207_4: U600.84(PD3) ; port !IO-VDD_SERVO_IN_FAULT
NetU208_3: U600.2(PE3) ; port IO-!RESET
NetU300_5: U600.57(PD10) ; port !BARO_CS
NetU301_5: U600.88(PD7) ; port !GYRO_CS
NetU301_6: U600.35(PB0) ; port GYRO_DRDY
NetU302_8: U600.58(PD11) ; port !MPU_CS
NetU302_12: U600.36(PB1) ; port MPU_DRDY
NetU303_8: U600.85(PD4) ; port !ACC_MAG_CS
NetU303_9: U600.91(PB5) ; port MAG_DRDY
NetU303_11: U600.90(PB4) ; port ACC_DRDY
NetU401_2: U600.48(PB11) ; port FMU-I2C2_SDA
NetU401_3: U600.47(PB10) ; port FMU-I2C2_SCL
NetU500_1: U600.40(PE9) ; port FMU-M1
NetU500_3: U600.42(PE11) ; port FMU-M2
NetU500_4: U600.44(PE13) ; port FMU-M3
NetU500_5: U600.45(PE14) ; port FMU-M4
NetU500_6: U600.59(PD12) ; port FMU-M5
NetU500_7: U600.60(PD13) ; port FMU-M6
NetU500_8: U600.61(PD14) ; port FMU-F1
NetU500_9: U600.62(PD15) ; port FMU-F2
NetU502_7: U600.51(PB12) ; port !SBUS_OUTPUT_EN
NetU503_4: U600.71(PA12) ; port OTG_FS_DP
NetU503_6: U600.70(PA11) ; port OTG_FS_DM
NetU504_5: U600.80(PC12) ; port SDIO_CK

Not connected (* = marked no-connect by the designer): U600 3(PE4) 38(PE7) 39(PE8) 41(PE10) 43(PE12) 46(PE15)

### Layout directives
net class Tiny_componet: FRAM_MISO, FRAM_MOSI, FRAM_SCK, GND

### Notes on the sheet
- uart allocation:
  PB6-7:    UART1 -> TELEM
  PD5-6 :   UART2 -> SBUS
  PD8-9:    UART3 -> GPS
  PA0-1 :   UART4 -> DEBUG
- spi allocation:
  PA5-7:     SPI1 -> SENSORS <internal>
  PB13-15: SPI2 -> FRAM
  PE2,5,6:  SPI4 -> external SPI
- Note: MAG/ACCEL/GYRO_DRDY pins chosen
  for both timer capture and separate
  EXTI operaton.
  EXTI0 - TIM3_CH3 - GYRO1
  EXTI1 - <free>
  EXTI2 - <free>
  EXTI3 - <free>
  EXTI4 - TIM3_CH1 - ACCEL
  EXTI5-9 - TIM3_CH2 - MAG
- adc allocation:
  PA2: ADC123_IN2 -> battery voltage
  PA3: ADC123_IN3 -> battery current
  PA4: ADC12_IN3    ->VDD 5V
  PC3: ADC123_IN13->VDD sensor in
  PC4: ADC12_IN14 -> pressure sensor
  PC5: ADC12_IN15 -> aux adc in #1
- Timer allocation:
  PE9:   TIM1_CH1: FMU-M1
  PE11: TIM1_CH2: FMU-M2
  PE13: TIM1_CH3: FMU-M3
  PE14: TIM1_CH4: FMU-M4
  PA15: TIM2_CH1: ALARM
  PB4: TIM3_CH1: ACCEL_DRDY
  PB5: TIM3_CH2: MAG_DRDY
  PB0: TIM3_CH3: GYRO_DRDY
  PB1: TIM3_CH4: MPU_DRDY
  PD12: TIM4_CH1: FMU-M5
  PD13: TIM4_CH2: FMU-M6
  PD14: TIM4_CH3: FMU-F1
  PD15: TIM4_CH4: FMU-F2
  PC6: TIM8_CH1:PPM_IN
  PC7: TIM8_CH2:RSSI_IN
- Title:
- Date:
- Drawn by:
- @
- Sheet:       /

### Library data of the parts
B600 = MS621FE: MS Lithium Rechargeable Battery
C600-C608 C_600 C_601 = CAP0603: as C500 on sheet interface; Supplier 1: Digi-Key; Supplier Part Number 1: 445-7438-1-ND
  C600-C602 C605-C608: Value: 0u1
  C603 C604: Value: 2u2
  C_600 C_601: Value: 8p
D600 = DIODE-SCHOTTKY_SOD323: DIODE SCHOTTKY 30V 0.03A SOD323; 3DR_PARTNO: ECM0839; Supplier 1: Digi-Key; Value: 30V; Supplier Part Number 1: RB751V40T1GOSCT-ND
R600 R601 = RESISTOR0603-RES: as R500 on sheet interface; Supplier 1: Digi-Key; Supplier Part Number 1: 1276-5014-1-ND
  R600: Value: 1K
  R601: Value: 10K
U600 = STM32F4X7VX_1: REV 3 Silicon or later IC MCU ARM 2MB FLASH 100LQFP; 3DR_PARTNO: ECM0841; Supplier 1: Digi-Key
U601 = FM25V01: IC FRAM 128KBIT 40MHZ 8SOIC; PARTNO: FM25V01-G; 3DR_PARTNO: ECM0826; Value: 128k; DATASHEET: http://www.ramtron.com/files/datasheets/FM25V01_ds.pdf; LINK: http://www.digikey.com/product-detail/en/FM25V01-GTR/1140-1026-1-ND/2809832; MFGPN: FM25V01; Supplier 1: Digi-Key
X600 = OSCILLATOR-3.2X2.5: CRYSTAL 24MHZ 8PF SMD; 3DR_PARTNO: ECM0708; PARTNO: NX3225SA-24.000MHZ-STD-CSR-1; Supplier 1: Digi-Key; Value: 24MHz

## Sheet LEDs.SchDoc: Your title
size A4; Date: 2017/06/29; DrawnBy: 亓岳鑫; Revision: Alfa 0.1; SheetNumber: 4; SheetTotal: 6; Time: 19:01
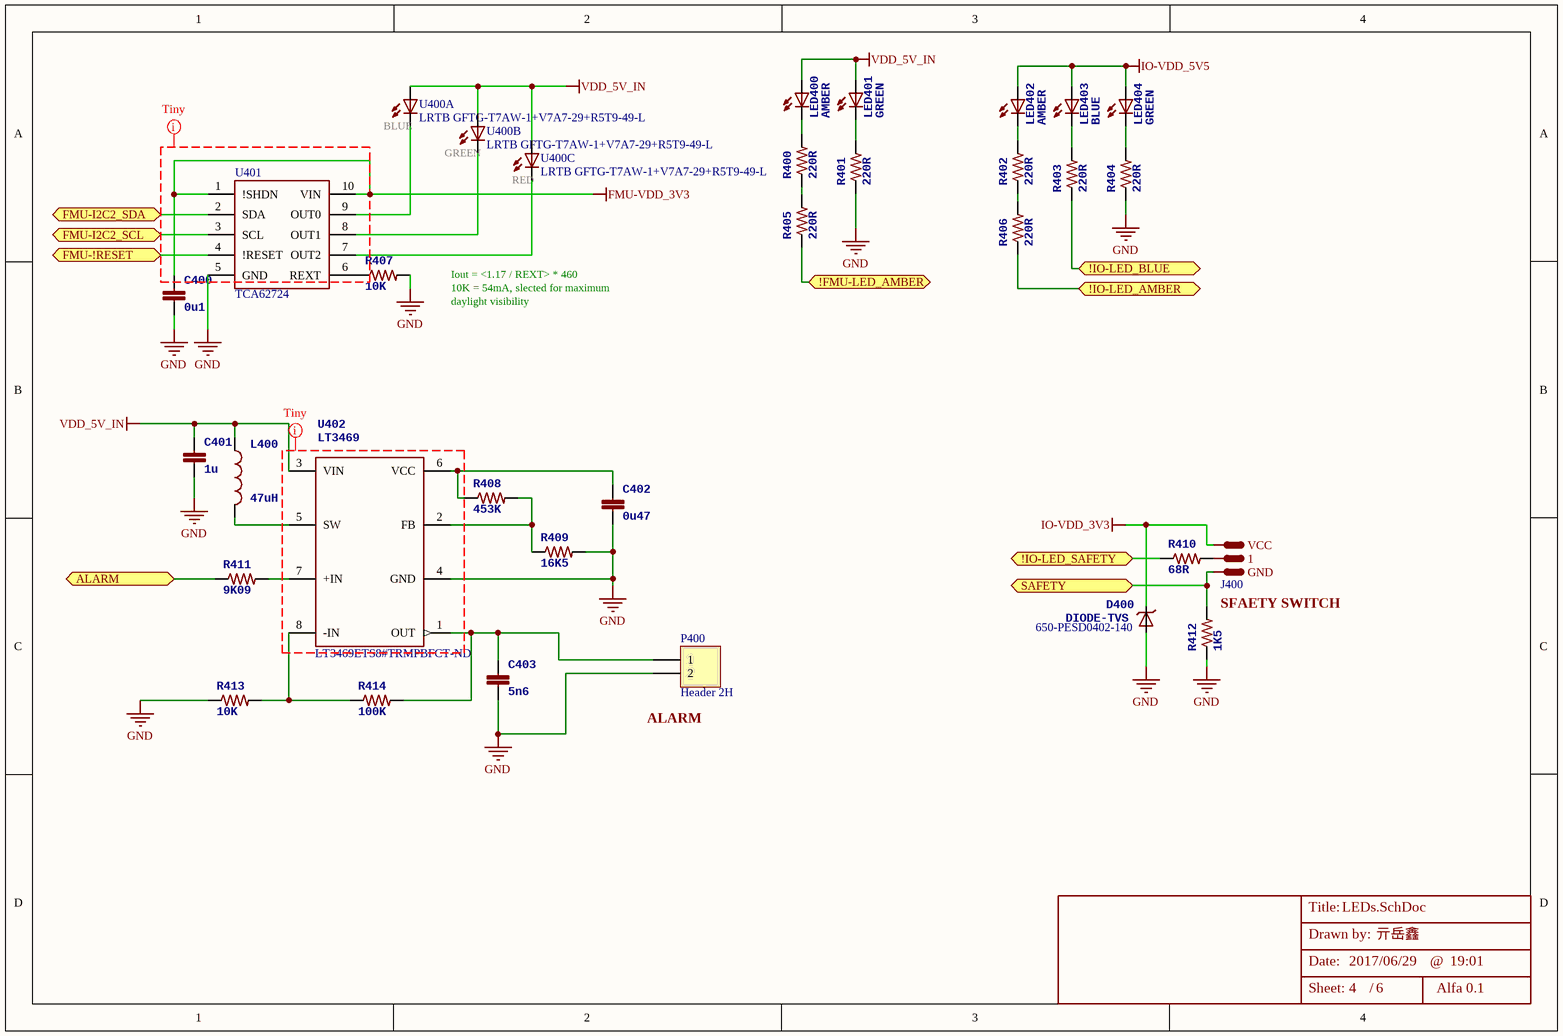
[diagram p3: LEDs.SchDoc]

### Parts
C400  0u1  [0603-CAP]
C401  1u  [0603-CAP]
C402  0u47  [0603-CAP]
C403  5n6  [0603-CAP]
D400  DIODE-TVS  Supplier Part Number 1: 650-PESD0402-140  [0402-TVS]
J400  HDR 3X1  [HDR3X1H]  (value not drawn)
L400  47uH  [0805-IND]
LED400  AMBER  [0603-LED]
LED401  GREEN  [0603-LED]
LED402  AMBER  [0603-LED]
LED403  BLUE  [0603-LED]
LED404  GREEN  [0603-LED]
P400  Header 2H  [HDR1X2H]
R400  220R  [0603-RES]
R401  220R  [0603-RES]
R402  220R  [0603-RES]
R403  220R  [0603-RES]
R404  220R  [0603-RES]
R405  220R  [0603-RES]
R406  220R  [0603-RES]
R407  10K  [0603-RES]
R408  453K  [0603-RES]
R409  16K5  [0603-RES]
R410  68R  [0603-RES]
R411  9K09  [0603-RES]
R412  1K5  [0603-RES]
R413  10K  [0603-RES]
R414  100K  [0603-RES]
U400  LRTB GFTG-T7AW-1+V7A7-29+R5T9-49-L  [P-LCC-6]  (parts A,B,C of 3)
U401  TCA62724  [SON10]
U402  LT3469  Supplier Part Number 1: LT3469ETS8#TRMPBFCT-ND  [SOT23-8]

### Ports
!FMU-LED_AMBER, !IO-LED_AMBER, !IO-LED_BLUE, !IO-LED_SAFETY, ALARM, FMU-!RESET, FMU-I2C2_SCL, FMU-I2C2_SDA, SAFETY

### Nets
FMU-VDD_3V3: C400.P$1 D400.C J400.VCC U401.1(!SHDN) U401.10(VIN)  [also labelled IO-VDD_3V3]
GND: C400.P$2 C401.P$2 C402.P$2 C403.P$2 D400.A P400.2 R401.1 R404.1 R407.2 R409.2 R412.1 R413.1 U401.5(GND) U402.4(GND)
IO-VDD_5V5: LED402.A LED403.A LED404.A
VDD_5V_IN: C401.P$1 L400.P$1 LED400.A LED401.A U400.A1(A) U400.A2(A) U400.A3(A) U402.3(VIN)
FMU-!RESET: U401.4(!RESET) ; port FMU-!RESET
NetC402_P$1: C402.P$1 R408.1 U402.6(VCC)
NetC403_P$1: C403.P$1 P400.1 R414.2 U402.1(OUT)
NetJ400_1: J400.1 R410.2
NetJ400_GND: J400.GND R412.2 ; port SAFETY
NetL400_P$2: L400.P$2 U402.5(SW)
NetLED400_C: LED400.C R400.2
NetLED401_C: LED401.C R401.2
NetLED402_C: LED402.C R402.2
NetLED403_C: LED403.C R403.2
NetLED404_C: LED404.C R404.2
NetR400_1: R400.1 R405.2
NetR402_1: R402.1 R406.2
NetR403_1: R403.1 ; port !IO-LED_BLUE
NetR405_1: R405.1 ; port !FMU-LED_AMBER
NetR406_1: R406.1 ; port !IO-LED_AMBER
NetR407_1: R407.1 U401.6(REXT)
NetR408_2: R408.2 R409.1 U402.2(FB)
NetR410_1: R410.1 ; port !IO-LED_SAFETY
NetR411_1: R411.1 ; port ALARM
NetR411_2: R411.2 U402.7(+IN)
NetR413_2: R413.2 R414.1 U402.8(-IN)
NetU400_C1: U400.C1(C) U401.9(OUT0)
NetU400_C2: U400.C2(C) U401.8(OUT1)
NetU400_C3: U400.C3(C) U401.7(OUT2)
NetU401_2: U401.2(SDA) ; port FMU-I2C2_SDA
NetU401_3: U401.3(SCL) ; port FMU-I2C2_SCL

### Layout directives
net class Tiny_componet: (no net found under the mark)

### Notes on the sheet
- Iout = <1.17 / REXT> * 460
- 10K = 54mA, slected for maximum
- daylight visibility
- SFAETY SWITCH
- (near P400) ALARM
- Title:
- Date:
- Drawn by:
- @
- Sheet:       /
- (in symbol MULTI-LEDS, part A) BLUE
- (in symbol MULTI-LEDS, part B) GREEN
- (in symbol MULTI-LEDS, part C) RED

### Library data of the parts
C400-C403 = CAP0603: as C500 on sheet interface; Supplier 1: Digi-Key; Supplier Part Number 1: 445-7438-1-ND
  C400: Value: 0u1
  C401: Value: 1u
  C402: Value: 0u47
  C403: Value: 5n6
D400 = DIODE-TVS: as D500 on sheet interface; Supplier 1: Mouser
J400 = HDR 3X1: Header 3X1 pins
L400 = INDUCTOR0805: FIXED IND 47UH 170MA 4.81 OHM; PARTNO: MLZ2012M470W; 3DR_PARTNO: ECM0814; Supplier 1: Digi-Key; Supplier Part Number 1: 445-17079-1-ND; Value: 47UH
LED400-LED404 = LED0603: LED 1.6X0.8 DOME ORN CLEAR SMD; PARTNO: APTD1608SECK; 3DR_PARTNO: ECM0515; Supplier 1: Digi-Key; Supplier Part Number 1: 754-1802-1-ND
  LED400 LED402: Value: AMBER
  LED401 LED404: Value: GREEN
  LED403: Value: BLUE
P400 = Header 2H: Header, 2-Pin, Right Angle; LatestRevisionDate: 17-Jul-2002; LatestRevisionNote: Re-released for DXP Platform.; Publisher: Altium Limited
R400-R414 = RESISTOR0603-RES: as R500 on sheet interface; Supplier 1: Digi-Key; Supplier Part Number 1: 1276-5014-1-ND
  R400-R406: Value: 220R
  R407 R413: Value: 10K
  R408: Value: 453K
  R409: Value: 16K5
  R410: Value: 68R
  R411: Value: 9K09
  R412: Value: 1K5
  R414: Value: 100K
U400 = MULTI-LEDS: Muti LEDs
U401 = TCA62724: 3-Channel Constant-Current LED Driver
U402 = LT3469: IC AMP DVR W/REG 1.3MHZ TSOT23-8; 3DR_PARTNO: ECM0829; Value: BUZZER; Supplier 1: Digi-Key

## Sheet sensors.SchDoc: Your title
size A4; Date: 2017/06/29; DrawnBy: ØÁÔÀöÎ; Revision: Alfa 0.1; SheetNumber: 3; SheetTotal: 6; Time: 19:01
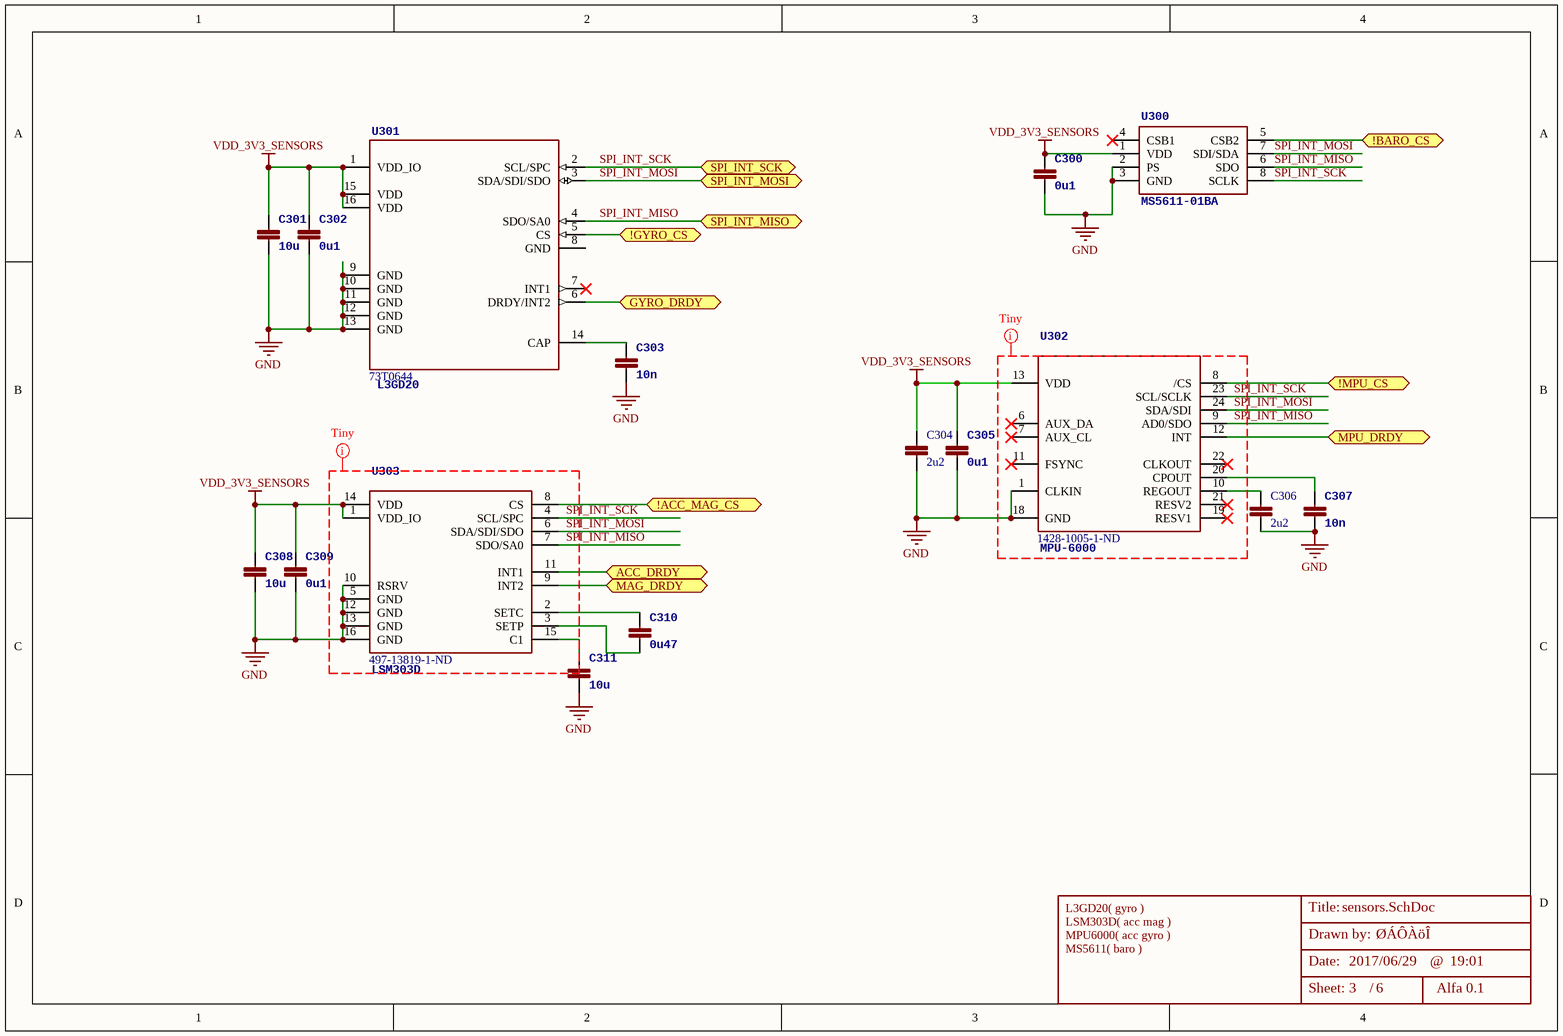
[diagram p4: sensors.SchDoc]

### Parts
C300  0u1  [0603-CAP]
C301  10u  [0603-CAP]
C302  0u1  [0603-CAP]
C303  10n  [0603-CAP]
C304  2u2  [0603-CAP]
C305  0u1  [0603-CAP]
C306  2u2  [0603-CAP]
C307  10n  [0603-CAP]
C308  10u  [0603-CAP]
C309  0u1  [0603-CAP]
C310  0u47  [0603-CAP]
C311  10u  [0603-CAP]
U300  MS5611-01BA  [MS5611-01BA]
U301  L3GD20  Supplier Part Number 1: 73T0644  [L3GD20]
U302  MPU-6000  Supplier Part Number 1: 1428-1005-1-ND  [QFN-24]
U303  LSM303D  Supplier Part Number 1: 497-13819-1-ND  [LSM303D]

### Ports
!ACC_MAG_CS, !BARO_CS, !GYRO_CS, !MPU_CS, ACC_DRDY, GYRO_DRDY, MAG_DRDY, MPU_DRDY, SPI_INT_MISO, SPI_INT_MOSI, SPI_INT_SCK

### Nets
GND: C300.P$2 C301.P$2 C302.P$2 C303.P$2 C304.P$2 C305.P$2 C306.P$2 C307.P$2 C308.P$2 C309.P$2 C311.P$2 U300.2(PS) U300.3(GND) U301.9(GND) U301.10(GND) U301.11(GND) U301.12(GND) U301.13(GND) U302.1(CLKIN) U302.18(GND) U303.5(GND) U303.10(RSRV) U303.12(GND) U303.13(GND) U303.16(GND)
VDD_3V3_SENSORS: C300.P$1 C301.P$1 C302.P$1 C304.P$1 C305.P$1 C308.P$1 C309.P$1 U300.1(VDD) U301.1(VDD_IO) U301.15(VDD) U301.16(VDD) U302.13(VDD) U303.1(VDD_IO) U303.14(VDD)
SPI_INT_MISO: U300.6(SDO) U301.4(SDO/SA0) U302.9(AD0/SDO) U303.7(SDO/SA0) ; port SPI_INT_MISO
SPI_INT_MOSI: U300.7(SDI/SDA) U301.3(SDA/SDI/SDO) U302.24(SDA/SDI) U303.6(SDA/SDI/SDO) ; port SPI_INT_MOSI
SPI_INT_SCK: U300.8(SCLK) U301.2(SCL/SPC) U302.23(SCL/SCLK) U303.4(SCL/SPC) ; port SPI_INT_SCK
NetC303_P$1: C303.P$1 U301.14(CAP)
NetC306_P$1: C306.P$1 U302.10(REGOUT)
NetC307_P$1: C307.P$1 U302.20(CPOUT)
NetC310_P$1: C310.P$1 U303.2(SETC)
NetC310_P$2: C310.P$2 U303.3(SETP)
NetC311_P$1: C311.P$1 U303.15(C1)
NetU300_5: U300.5(CSB2) ; port !BARO_CS
NetU301_5: U301.5(CS) ; port !GYRO_CS
NetU301_6: U301.6(DRDY/INT2) ; port GYRO_DRDY
NetU302_8: U302.8(/CS) ; port !MPU_CS
NetU302_12: U302.12(INT) ; port MPU_DRDY
NetU303_8: U303.8(CS) ; port !ACC_MAG_CS
NetU303_9: U303.9(INT2) ; port MAG_DRDY
NetU303_11: U303.11(INT1) ; port ACC_DRDY

Not connected (* = marked no-connect by the designer): U300 4(CSB1)*; U301 7(INT1)* 8(GND); U302 2(NC1) 3(NC2) 4(NC3) 5(NC4) 6(AUX_DA)* 7(AUX_CL)* 11(FSYNC)* 14(NC5) 15(NC6) 16(NC7) 17(NC8) 19(RESV1)* 21(RESV2)* 22(CLKOUT)*

### Layout directives
net class Tiny_componet: SPI_INT_MISO, SPI_INT_MOSI, SPI_INT_SCK

### Notes on the sheet
- L3GD20( gyro )
- LSM303D( acc mag )
- MPU6000( acc gyro )
- MS5611( baro )
- Title:
- Date:
- Drawn by:
- @
- Sheet:       /

### Library data of the parts
C300-C311 = CAP0603: as C500 on sheet interface; Supplier 1: Digi-Key; Supplier Part Number 1: 445-7438-1-ND
  C300 C302 C305 C309: Value: 0u1
  C301 C308 C311: Value: 10u
  C303 C307: Value: 10n
  C304 C306: Value: 2u2
  C310: Value: 0u47
U300 = MS5611-01BA: Board Mount Pressure Sensors; 3DR_PARTNO: ECM0835; Value: 10-1200mbar; DATASHEET: http://www.meas-spec.com/downloads/MS5611-01BA01.pdf; LINK: http://www.meas-spec.com/product/t_product.aspx?id=8503#; MFGPN: MS5611-01BA; PARTNO: MS5611-01BA; Supplier 1: Mouser; Supplier Part Number 1: 824-MS561101BA03-50
U301 = L3GD20: Sensor, Low-power, Three-axis, Angular rate; 3DR_PARTNO: ECM0827; MFGPN: L3GD20; Supplier 1: Newark
U302 = MPU-6000: GYRO/ACCELEROMETER 6AXIS 24QFN; 3DR_PARTNO: ECM0834; DATASHEET: http://invensense.com/mems/gyro/documents/PS-MPU-6000A-00_v1.0.pdf; LINK: http://invensense.com/mems/gyro/mpu6000.html; MFGPN: MPU-6000; Supplier 1: Digi-Key; PARTNO: MPU-6000
U303 = LSM303D: Module, 3D Accelerometer, 3D Magnetometer; 3DR_PARTNO: ECM0828; DATASHEET: http://www.st.com/internet/com/TECHNICAL_RESOURCES/TECHNICAL_LITERATURE/DATASHEET/DM00057547.pdf; LINK: http://www.st.com/internet/analog/product/253884.jsp; MFGPN: LSM303D; Supplier 1: Digi-Key

## Sheet power.SchDoc: Your title
size A4; Date: 2017/06/29; DrawnBy: ØÁÔÀöÎ; Revision: Alfa 0.1; SheetNumber: 2; SheetTotal: 6; Time: 19:01
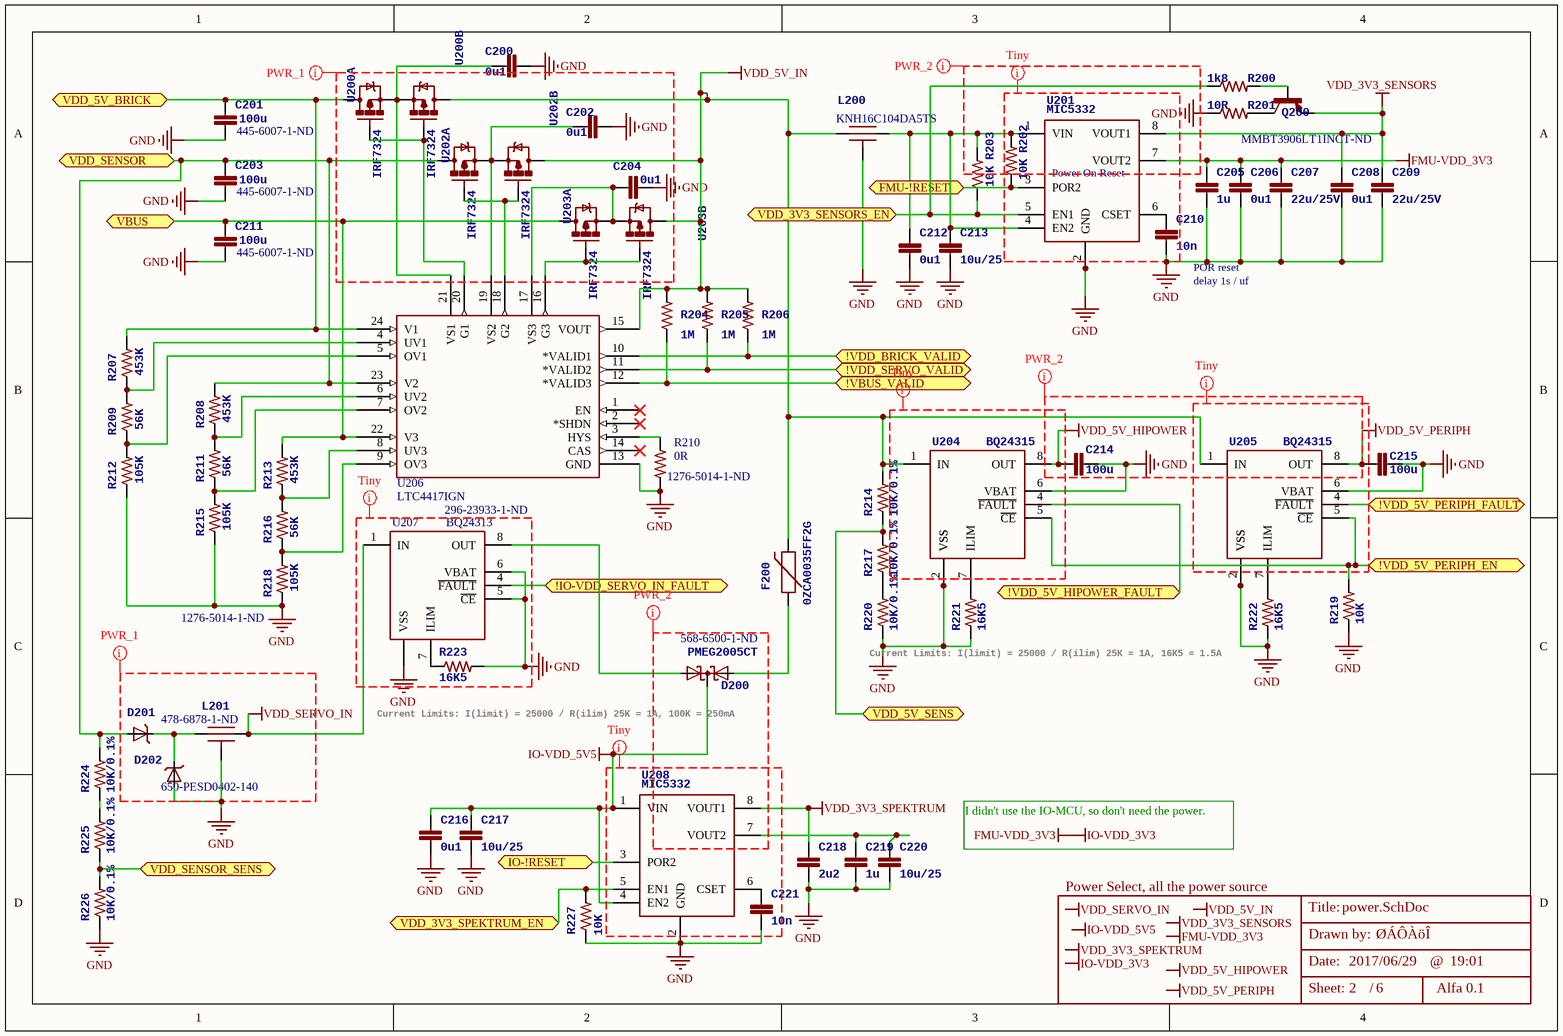
[diagram p5: power.SchDoc]

### Parts
C200  0u1  [0603-CAP]
C201  100u  Supplier Part Number 1: 445-6007-1-ND  [1206-CAP]
C202  0u1  [0603-CAP]
C203  100u  Supplier Part Number 1: 445-6007-1-ND  [1206-CAP]
C204  0u1  [0603-CAP]
C205  1u  [0603-CAP]
C206  0u1  [0603-CAP]
C207  22u/25V  [0805]
C208  0u1  [0603-CAP]
C209  22u/25V  [0805]
C210  10n  [0603-CAP]
C211  100u  Supplier Part Number 1: 445-6007-1-ND  [1206-CAP]
C212  0u1  [0603-CAP]
C213  10u/25  [0805]
C214  100u  [1206-CAP]
C215  100u  [1206-CAP]
C216  0u1  [0603-CAP]
C217  10u/25  [0805]
C218  2u2  [0603-CAP]
C219  1u  [0603-CAP]
C220  10u/25  [0805]
C221  10n  [0603-CAP]
D200  PMEG2005CT  Supplier Part Number 1: 568-6500-1-ND  [SOT23-3]
D201  DIODE-TVS  [0402-TVS]  (value not drawn)
D202  Supplier Part Number 1: 650-PESD0402-140  [0402-TVS]  (hidden comment: DIODE-TVS)
F200  0ZCA0035FF2G  [PTC-1206]
L200  Kyocera KNH16C104DA5TS EMI filter  [KYOCERA-KNH16-DA]  (value not drawn)
L201  Supplier Part Number 1: 478-6878-1-ND  [KYOCERA-KNH16-DA]  (hidden comment: Kyocera KNH16C104DA5TS EMI filter)
Q200  Supplier Part Number 1: MMBT3906LT1INCT-ND  [SOT23-BEC]  (hidden comment: MMBT3906*SMD)
R200  1k8  [0603-RES]
R201  10R  [0603-RES]
R202  10K  [0603-RES]
R203  10K  [0603-RES]
R204  1M  [0603-RES]
R205  1M  [0603-RES]
R206  1M  [0603-RES]
R207  453K  [0603-RES]
R208  453K  [0603-RES]
R209  56K  [0603-RES]
R210  0R  Supplier Part Number 1: 1276-5014-1-ND  [0603-RES]
R211  56K  [0603-RES]
R212  105K  [0603-RES]
R213  453K  [0603-RES]
R214  10K/0.1%  [0603-RES]
R215  105K  [0603-RES]
R216  56K  [0603-RES]
R217  10K/0.1%  [0603-RES]
R218  105K  Supplier Part Number 1: 1276-5014-1-ND  [0603-RES]
R219  10K  [0603-RES]
R220  10K/0.1%  [0603-RES]
R221  16K5  [0603-RES]
R222  16K5  [0603-RES]
R223  16K5  [0603-RES]
R224  10K/0.1%  [0603-RES]
R225  10K/0.1%  [0603-RES]
R226  10K/0.1%  [0603-RES]
R227  10K  [0603-RES]
U200  IRF7324  [SO08]  (parts A,B of 2)
U201  MIC5332  [MLF-8-EPAD]
U202  IRF7324  [SO08]  (parts A,B of 2)
U203  IRF7324  [SO08]  (parts A,B of 2)
U204  BQ24315  [QFN8-DSG]
U205  BQ24315  [QFN8-DSG]
U206  LTC4417IGN  [SSOP-24_GN]
U207  BQ24313  Supplier Part Number 1: 296-23933-1-ND  [QFN8-DSG]
U208  MIC5332  [MLF-8-EPAD]

### Ports
!IO-VDD_SERVO_IN_FAULT, !VBUS_VALID, !VDD_5V_HIPOWER_FAULT, !VDD_5V_PERIPH_EN, !VDD_5V_PERIPH_FAULT, !VDD_BRICK_VALID, !VDD_SERVO_VALID, FMU-!RESET, IO-!RESET, VBUS, VDD_3V3_SENSORS_EN, VDD_3V3_SPEKTRUM_EN, VDD_5V_BRICK, VDD_5V_SENS, VDD_SENSOR, VDD_SENSOR_SENS

### Nets
FMU-VDD_3V3: C205.P$1 C206.P$1 C207.1 U201.7(VOUT2)  [also labelled IO-VDD_3V3]
GND: C200.P$1 C201.P$2 C202.P$1 C203.P$2 C204.P$1 C205.P$2 C206.P$2 C207.2 C208.P$2 C209.2 C210.P$2 C211.P$2 C212.P$2 C213.2 C214.P$2 C215.P$2 C216.P$2 C217.2 C218.P$2 C219.P$2 C220.2 C221.P$2 D202.A L200.GND L201.GND R201.1 R210.1 R212.1 R215.1 R218.1 R219.1 R220.1 R221.1 R222.1 R223.2 R226.1 R227.1 U201.2(GND) U201.GND U204.2(VSS) U204.6(VBAT) U204.GND(VSS) U205.2(VSS) U205.6(VBAT) U205.GND(VSS) U206.13(GND) U207.2(VSS) U207.5(~{CE}) U207.6(VBAT) U207.GND(VSS) U208.2(GND) U208.GND
IO-VDD_5V5: C216.P$1 C217.1 D200.3(CC) U208.1(VIN) U208.4(EN2)
VDD_3V3_SENSORS: C208.P$1 C209.1 Q200.E U201.8(VOUT1)
VDD_3V3_SPEKTRUM: C218.P$1 U208.8(VOUT1)
VDD_5V_HIPOWER: C214.P$1 U204.8(OUT)
VDD_5V_IN: F200.2 L200.P$1 R204.2 R205.2 R206.2 R214.2 U200.5(D) U202.5(D) U203.5(D) U204.1(IN) U205.1(IN) U206.15(VOUT)
VDD_5V_PERIPH: C215.P$1 U205.8(OUT)
VDD_SERVO_IN: L201.P$2 U207.1(IN)
!VBUS_VALID: R204.1 U206.12(*VALID3) ; port !VBUS_VALID
!VDD_BRICK_VALID: R206.1 U206.10(*VALID1) ; port !VDD_BRICK_VALID
!VDD_SERVO_VALID: R205.1 U206.11(*VALID2) ; port !VDD_SERVO_VALID
FMU-!RESET: R202.1 U201.3(POR2) ; port FMU-!RESET
VBUS: C211.P$1 R213.2 U203.7(D) U206.22(V3) ; port VBUS
VDD_5V_BRICK: C201.P$1 R207.2 U200.7(D) U206.24(V1) ; port VDD_5V_BRICK
VDD_SENSOR: C203.P$1 D201.A R208.2 R224.2 U202.7(D) U206.23(V2) ; port VDD_SENSOR
NetC200_P$2: C200.P$2 U200.1(S) U200.3(S) U206.21(VS1)
NetC202_P$2: C202.P$2 U202.1(S) U202.3(S) U206.19(VS2)
NetC204_P$2: C204.P$2 U203.1(S) U203.3(S) U206.17(VS3)
NetC210_P$1: C210.P$1 U201.6(CSET)
NetC212_P$1: C212.P$1 C213.1 L200.P$2 R202.2 R203.2 U201.1(VIN) U201.4(EN2)
NetC219_P$1: C219.P$1 C220.1 U208.7(VOUT2)
NetC221_P$1: C221.P$1 U208.6(CSET)
NetD200_1: D200.1(A1) F200.1
NetD200_2: D200.2(A2) U207.8(OUT)
NetD201_C: D201.C D202.C L201.P$1
NetQ200_B: Q200.B R200.2
NetQ200_C: Q200.C R201.2
NetR200_1: R200.1 R203.1 U201.5(EN1) ; port VDD_3V3_SENSORS_EN
NetR207_1: R207.1 R209.2 U206.4(UV1)
NetR208_1: R208.1 R211.2 U206.6(UV2)
NetR209_1: R209.1 R212.2 U206.5(OV1)
NetR210_2: R210.2 U206.3(HYS)
NetR211_1: R211.1 R215.2 U206.7(OV2)
NetR213_1: R213.1 R216.2 U206.8(UV3)
NetR214_1: R214.1 R217.2 ; port VDD_5V_SENS
NetR216_1: R216.1 R218.2 U206.9(OV3)
NetR217_1: R217.1 R220.2
NetR219_2: R219.2 U204.5(~{CE}) U205.5(~{CE}) ; port !VDD_5V_PERIPH_EN
NetR221_2: R221.2 U204.7(ILIM)
NetR222_2: R222.2 U205.7(ILIM)
NetR223_1: R223.1 U207.7(ILIM)
NetR224_1: R224.1 R225.2
NetR225_1: R225.1 R226.2 ; port VDD_SENSOR_SENS
NetR227_2: R227.2 U208.5(EN1) ; port VDD_3V3_SPEKTRUM_EN
NetU200_2: U200.2(G) U200.4(G) U206.20(G1)
NetU202_2: U202.2(G) U202.4(G) U206.18(G2)
NetU203_2: U203.2(G) U203.4(G) U206.16(G3)
NetU204_4: U204.4(~{FAULT}) ; port !VDD_5V_HIPOWER_FAULT
NetU205_4: U205.4(~{FAULT}) ; port !VDD_5V_PERIPH_FAULT
NetU207_4: U207.4(~{FAULT}) ; port !IO-VDD_SERVO_IN_FAULT
NetU208_3: U208.3(POR2) ; port IO-!RESET

Not connected (* = marked no-connect by the designer): U206 1(EN)* 2(*SHDN)* 14(CAS)*

### Layout directives
net class PWR1_NetClass; rule Width Constraint [Pref Width = 30mil    Min Width = 10mil    Max Width = 60mil]: GND, VDD_SERVO_IN
net class PWR2_NetClass; rule Width Constraint [Pref Width = 20mil    Min Width = 10mil    Max Width = 30mil]: (no net found under the mark), GND, VDD_5V_HIPOWER, VDD_5V_PERIPH
net class Tiny_componet: (no net found under the mark), GND, VDD_5V_HIPOWER, VDD_5V_PERIPH

### Notes on the sheet
- (near U201) Power On Reset
- (near C210) POR reset
- delay 1s / uf
- Current Limits:
  I(limit) = 25000 / R(ilim)
  25K = 1A, 16K5 = 1.5A
- Current Limits:
  I(limit) = 25000 / R(ilim)
  25K = 1A, 100K = 250mA
- I didn't use the IO-MCU, so don't need the power.
- Power Select, all the power source
- Labels drawn without touching a wire or pin: FMU-VDD_3V3, IO-VDD_3V3, IO-VDD_5V5, VDD_3V3_SENSORS, VDD_3V3_SPEKTRUM, VDD_5V_HIPOWER, VDD_5V_IN, VDD_5V_PERIPH, VDD_SERVO_IN
- Title:
- Date:
- Drawn by:
- @
- Sheet:       /

### Library data of the parts
C200 C202 C204-C206 C208 C210 C212 C216 C218 C219 C221 = CAP0603: as C500 on sheet interface; Supplier 1: Digi-Key; Supplier Part Number 1: 445-7438-1-ND
  C200 C202 C204 C206 C208 C212 C216: Value: 0u1
  C205 C219: Value: 1u
  C210 C221: Value: 10n
  C218: Value: 2u2
C201 C203 C211 C214 C215 = CAP1206: CAP CER 100UF 10V 20% X5R 1206; PARTNO: C3216X5R1A107M160AC; 3DR_PARTNO: ECM0716; Supplier 1: Digi-Key; Value: 100U
  C214 C215: Supplier Part Number 1: 445-6007-1-ND
C207 C209 C213 C217 C220 = CAP0805: CAP CER 4.7UF 16V 10% X7R 0805; PARTNO: CL21B475KOFNNNE; 3DR_PARTNO: ECM0622; DATASHEET: http://www.digikey.com/product-detail/en/CL21B475KOFNNNE/1276-2873-2-ND/3888531; Supplier 1: Digi-Key; Supplier Part Number 1: 1276-2873-1-ND
  C207 C209: Value: 22u/25V
  C213 C217 C220: Value: 10u/25
D200 = PMEG2005CT: DIODE SCHOTTKY 20V 500MA TO236AB; 3DR_PARTNO: ECM0838; PARTNO: PMEG2005CT; Supplier 1: Digi-Key; Value: 20V
D201 D202 = DIODE-TVS: as D500 on sheet interface; Supplier 1: Mouser
  D201: Supplier Part Number 1: 650-PESD0402-140
F200 = PTCSMD: PTC RESTTBLE 0.35A 16V CHIP 1206; 3DR_PARTNO: ECM0802; PARTNO: 0ZCA0035FF2G; Supplier 1: Digi-Key; Supplier Part Number 1: 507-1479-1-ND; Value: 0.35A
L200 L201 = KNH16C104DA5TS: as L500 on sheet interface; Supplier 1: Digi-Key; PARTNO: KNH16C104DA5TS
  L200: Supplier Part Number 1: 478-6878-1-ND
Q200 = MMBT3906*SMD: TRANSISTOR SWITCHING PNP SOT-23; 3DR_PARTNO: ECM0833; PARTNO: MMBT 3906 LT1; Supplier 1: Digi-Key
R200-R209 R211-R227 = RESISTOR0603-RES: as R500 on sheet interface; Supplier 1: Digi-Key
  R200: Supplier Part Number 1: 1276-5014-1-ND; Value: 1k8
  R201: Supplier Part Number 1: 1276-5014-1-ND; Value: 10R
  R202 R203 R219 R227: Supplier Part Number 1: 1276-5014-1-ND; Value: 10K
  R204-R206: Supplier Part Number 1: 1276-5014-1-ND; Value: 1M
  R207 R208 R213: Supplier Part Number 1: 1276-5014-1-ND; Value: 453K
  R209 R211 R216: Supplier Part Number 1: 1276-5014-1-ND; Value: 56K
  R212 R215: Supplier Part Number 1: 1276-5014-1-ND; Value: 105K
  R214 R217 R220 R224-R226: Supplier Part Number 1: 1276-5014-1-ND; Value: 10K/0.1%
  R218: Value: 105K
  R221-R223: Supplier Part Number 1: 1276-5014-1-ND; Value: 16K5
R210 = RESISTOR0603-RES: RES 10 OHM 1/10W 5% 0603; PARTNO: RC1608J100CS; 3DR_PARTNO: ECM0811; Value: 10R; Supplier 1: Digi-Key
U200 U202 U203 = PMOSFET-DUAL: MOSFET 2P-CH 20V 2.9A CHIPFET; 3DR_PARTNO: EMC0901; Supplier 1: Digi-Key; Supplier 2: Mouser; Value: 20V 2.9A
U201 U208 = MIC5332: IC REG LDO 3.3V 0.3A 8TMLF; 3DR_PARTNO: ECM0832; PARTNO: MIC5332-SSYMT TR; Supplier 1: Digi-Key; Supplier Part Number 1: 576-4110-1-ND; Value: 3.3V
U204 U205 = BQ24315: IC LI+ CHARGER FRONT END 8SON; 3DR_PARTNO: ECM0541; Value: 3.3V-30V; Supplier 1: Digi-Key; Supplier Part Number 1: 296-32030-1-ND
U206 = LTC4417IGN#TRPBF: Selects Highest Priority Supply from Three Inputs; Vendor: Linear Technology; Manufacturer_Part_Number: ltc4417ign#trpbf; Value: Value; Type: Type; RefDes: RefDes
U207 = BQ24313: IC LI+ CHARGER FRONT END 8-SON; 3DR_PARTNO: ECM0824; PARTNO: BQ24313DSGT; Supplier 1: Digi-Key

## Nets that join several sheets
FMU-VDD_3V3: top (FMU_3V3.P$1), interface (19 pins), fmu (13 pins), LEDs (5 pins), power (C205.P$1 C206.P$1 C207.1 U201.7)
GND: top (GND.P$1 GND..P$1), interface (35 pins), fmu (18 pins), LEDs (14 pins), sensors (25 pins), power (52 pins)
IO-VDD_5V5: top (IO_5V.P$1), interface (J502.VCC), LEDs (LED402.A LED403.A LED404.A), power (5 pins)
VDD_3V3_SENSORS: top (3V3_SEN.P$1), sensors (14 pins), power (C208.P$1 C209.1 Q200.E U201.8)
VDD_5V_HIPOWER: top (5V_HIP.P$1), interface (J504.VCC), power (C214.P$1 U204.8)
VDD_5V_IN: top (5V_IN.P$1), LEDs (8 pins), power (12 pins)
VDD_5V_PERIPH: top (5V_PER.P$1), interface (J506.VCC J507.1 L502.P$2), power (C215.P$1 U205.8)
!VBUS_VALID: top (!VBUS_EN.P$1), fmu (U600.7), power (R204.1 U206.12)
!VDD_BRICK_VALID: top (!BRI_EN.P$1), fmu (U600.8), power (R206.1 U206.10)
!VDD_SERVO_VALID: top (!SRV_EN.P$1), fmu (U600.9), power (R205.1 U206.11)
FMU-!RESET: fmu (C607.P$2 U600.14), LEDs (U401.4), power (R202.1 U201.3)
FMU-BOOT0: top (FMU-BOOT0.P$1), fmu (R601.2 U600.94)
FMU-UART1_RX: top (S1RX.P$1), interface (U501.3), fmu (U600.93)
FMU-UART1_TX: top (S1TX.P$1), interface (U501.1), fmu (U600.92)
FMU-UART3_RX: top (S3RX.P$1), interface (U501.7), fmu (U600.56)
FMU-UART3_TX: top (S3TX.P$1), interface (U501.6), fmu (U600.55)
FMU-UART4_RX: top (S4RX.P$1), interface (U501.9), fmu (U600.24)
FMU-UART4_TX: top (S4TX.P$1), interface (U501.8), fmu (U600.23)
NetC502_P$2: interface (C502.P$2 R512.2 R513.2), fmu (U600.33)
NetD501_C: interface (D501.C R524.1 U502.2), fmu (U600.63)
NetJ400_GND: fmu (U600.97), LEDs (J400.GND R412.2)
NetJ507_2: interface (J507.2), fmu (U600.1)
NetJ507_3: interface (J507.3), fmu (U600.5)
NetJ507_4: interface (J507.4), fmu (U600.4)
NetJ508_2: interface (J508.2), fmu (U600.76)
NetJ508_3: interface (J508.3), fmu (U600.72)
NetJ508_4: interface (J508.4), fmu (U600.89)
NetR200_1: fmu (U600.69), power (R200.1 R203.1 U201.5)
NetR214_1: fmu (U600.29), power (R214.1 R217.2)
NetR219_2: fmu (U600.67), power (R219.2 U204.5 U205.5)
NetR225_1: fmu (U600.18), power (R225.1 R226.2)
NetR227_2: fmu (U600.37), power (R227.2 U208.5)
NetR403_1: fmu (U600.15), LEDs (R403.1)
NetR405_1: fmu (U600.17), LEDs (R405.1)
NetR406_1: fmu (U600.16), LEDs (R406.1)
NetR410_1: fmu (U600.98), LEDs (R410.1)
NetR411_1: fmu (U600.77), LEDs (R411.1)
NetR500_2: interface (R500.2), fmu (U600.26)
NetR503_2: interface (R503.2), fmu (U600.25)
NetR516_1: interface (R516.1), fmu (U600.34)
NetR521_2: interface (R521.2 R525.1), fmu (U600.95)
NetR522_2: interface (R522.2 R523.1), fmu (U600.96)
NetR527_1: interface (R527.1), fmu (U600.64)
NetR528_1: interface (R528.1 U504.1), fmu (U600.78)
NetR529_1: interface (R529.1 U504.2), fmu (U600.79)
NetR530_1: interface (R530.1 U504.3), fmu (U600.83)
NetR531_1: interface (R531.1 U504.7), fmu (U600.65)
NetR532_1: interface (R532.1 U504.8), fmu (U600.66)
NetU204_4: fmu (U600.82), power (U204.4)
NetU205_4: fmu (U600.81), power (U205.4)
NetU207_4: fmu (U600.84), power (U207.4)
NetU208_3: fmu (U600.2), power (U208.3)
NetU300_5: fmu (U600.57), sensors (U300.5)
NetU301_5: fmu (U600.88), sensors (U301.5)
NetU301_6: fmu (U600.35), sensors (U301.6)
NetU302_8: fmu (U600.58), sensors (U302.8)
NetU302_12: fmu (U600.36), sensors (U302.12)
NetU303_8: fmu (U600.85), sensors (U303.8)
NetU303_9: fmu (U600.91), sensors (U303.9)
NetU303_11: fmu (U600.90), sensors (U303.11)
NetU401_2: fmu (U600.48), LEDs (U401.2)
NetU401_3: fmu (U600.47), LEDs (U401.3)
NetU500_1: interface (U500.1), fmu (U600.40)
NetU500_3: interface (U500.3), fmu (U600.42)
NetU500_4: interface (U500.4), fmu (U600.44)
NetU500_5: interface (U500.5), fmu (U600.45)
NetU500_6: interface (U500.6), fmu (U600.59)
NetU500_7: interface (U500.7), fmu (U600.60)
NetU500_8: interface (U500.8), fmu (U600.61)
NetU500_9: interface (U500.9), fmu (U600.62)
NetU502_7: interface (U502.7), fmu (U600.51)
NetU503_4: interface (U503.4), fmu (U600.71)
NetU503_6: interface (U503.6), fmu (U600.70)
NetU504_5: interface (U504.5), fmu (U600.80)
PRESSURE_SENS_IN: top (PRE_SENS_IN.P$1), interface (J503.1 R512.1)
SBUS_INPUT: top (S2RX.P$1), interface (U502.6), fmu (U600.87)
SBUS_OUTPUT: top (S2TX.P$1), interface (U502.5), fmu (U600.86)
SPI_INT_MISO: fmu (U600.31), sensors (U300.6 U301.4 U302.9 U303.7)
SPI_INT_MOSI: fmu (U600.32), sensors (U300.7 U301.3 U302.24 U303.6)
SPI_INT_SCK: fmu (U600.30), sensors (U300.8 U301.2 U302.23 U303.4)
VBUS: top (VBUS.P$1), interface (J509.VBUS U503.5), fmu (U600.68), power (C211.P$1 R213.2 U203.7 U206.22)
VDD_5V_BRICK: top (5V_BRI.P$1), interface (J500.VCC), power (C201.P$1 R207.2 U200.7 U206.24)
VDD_SENSOR: top (5V_SEN.P$1), interface (J501.VCC), power (6 pins)